# Altium project MainBoard.PrjPcb (part 1 of 2)
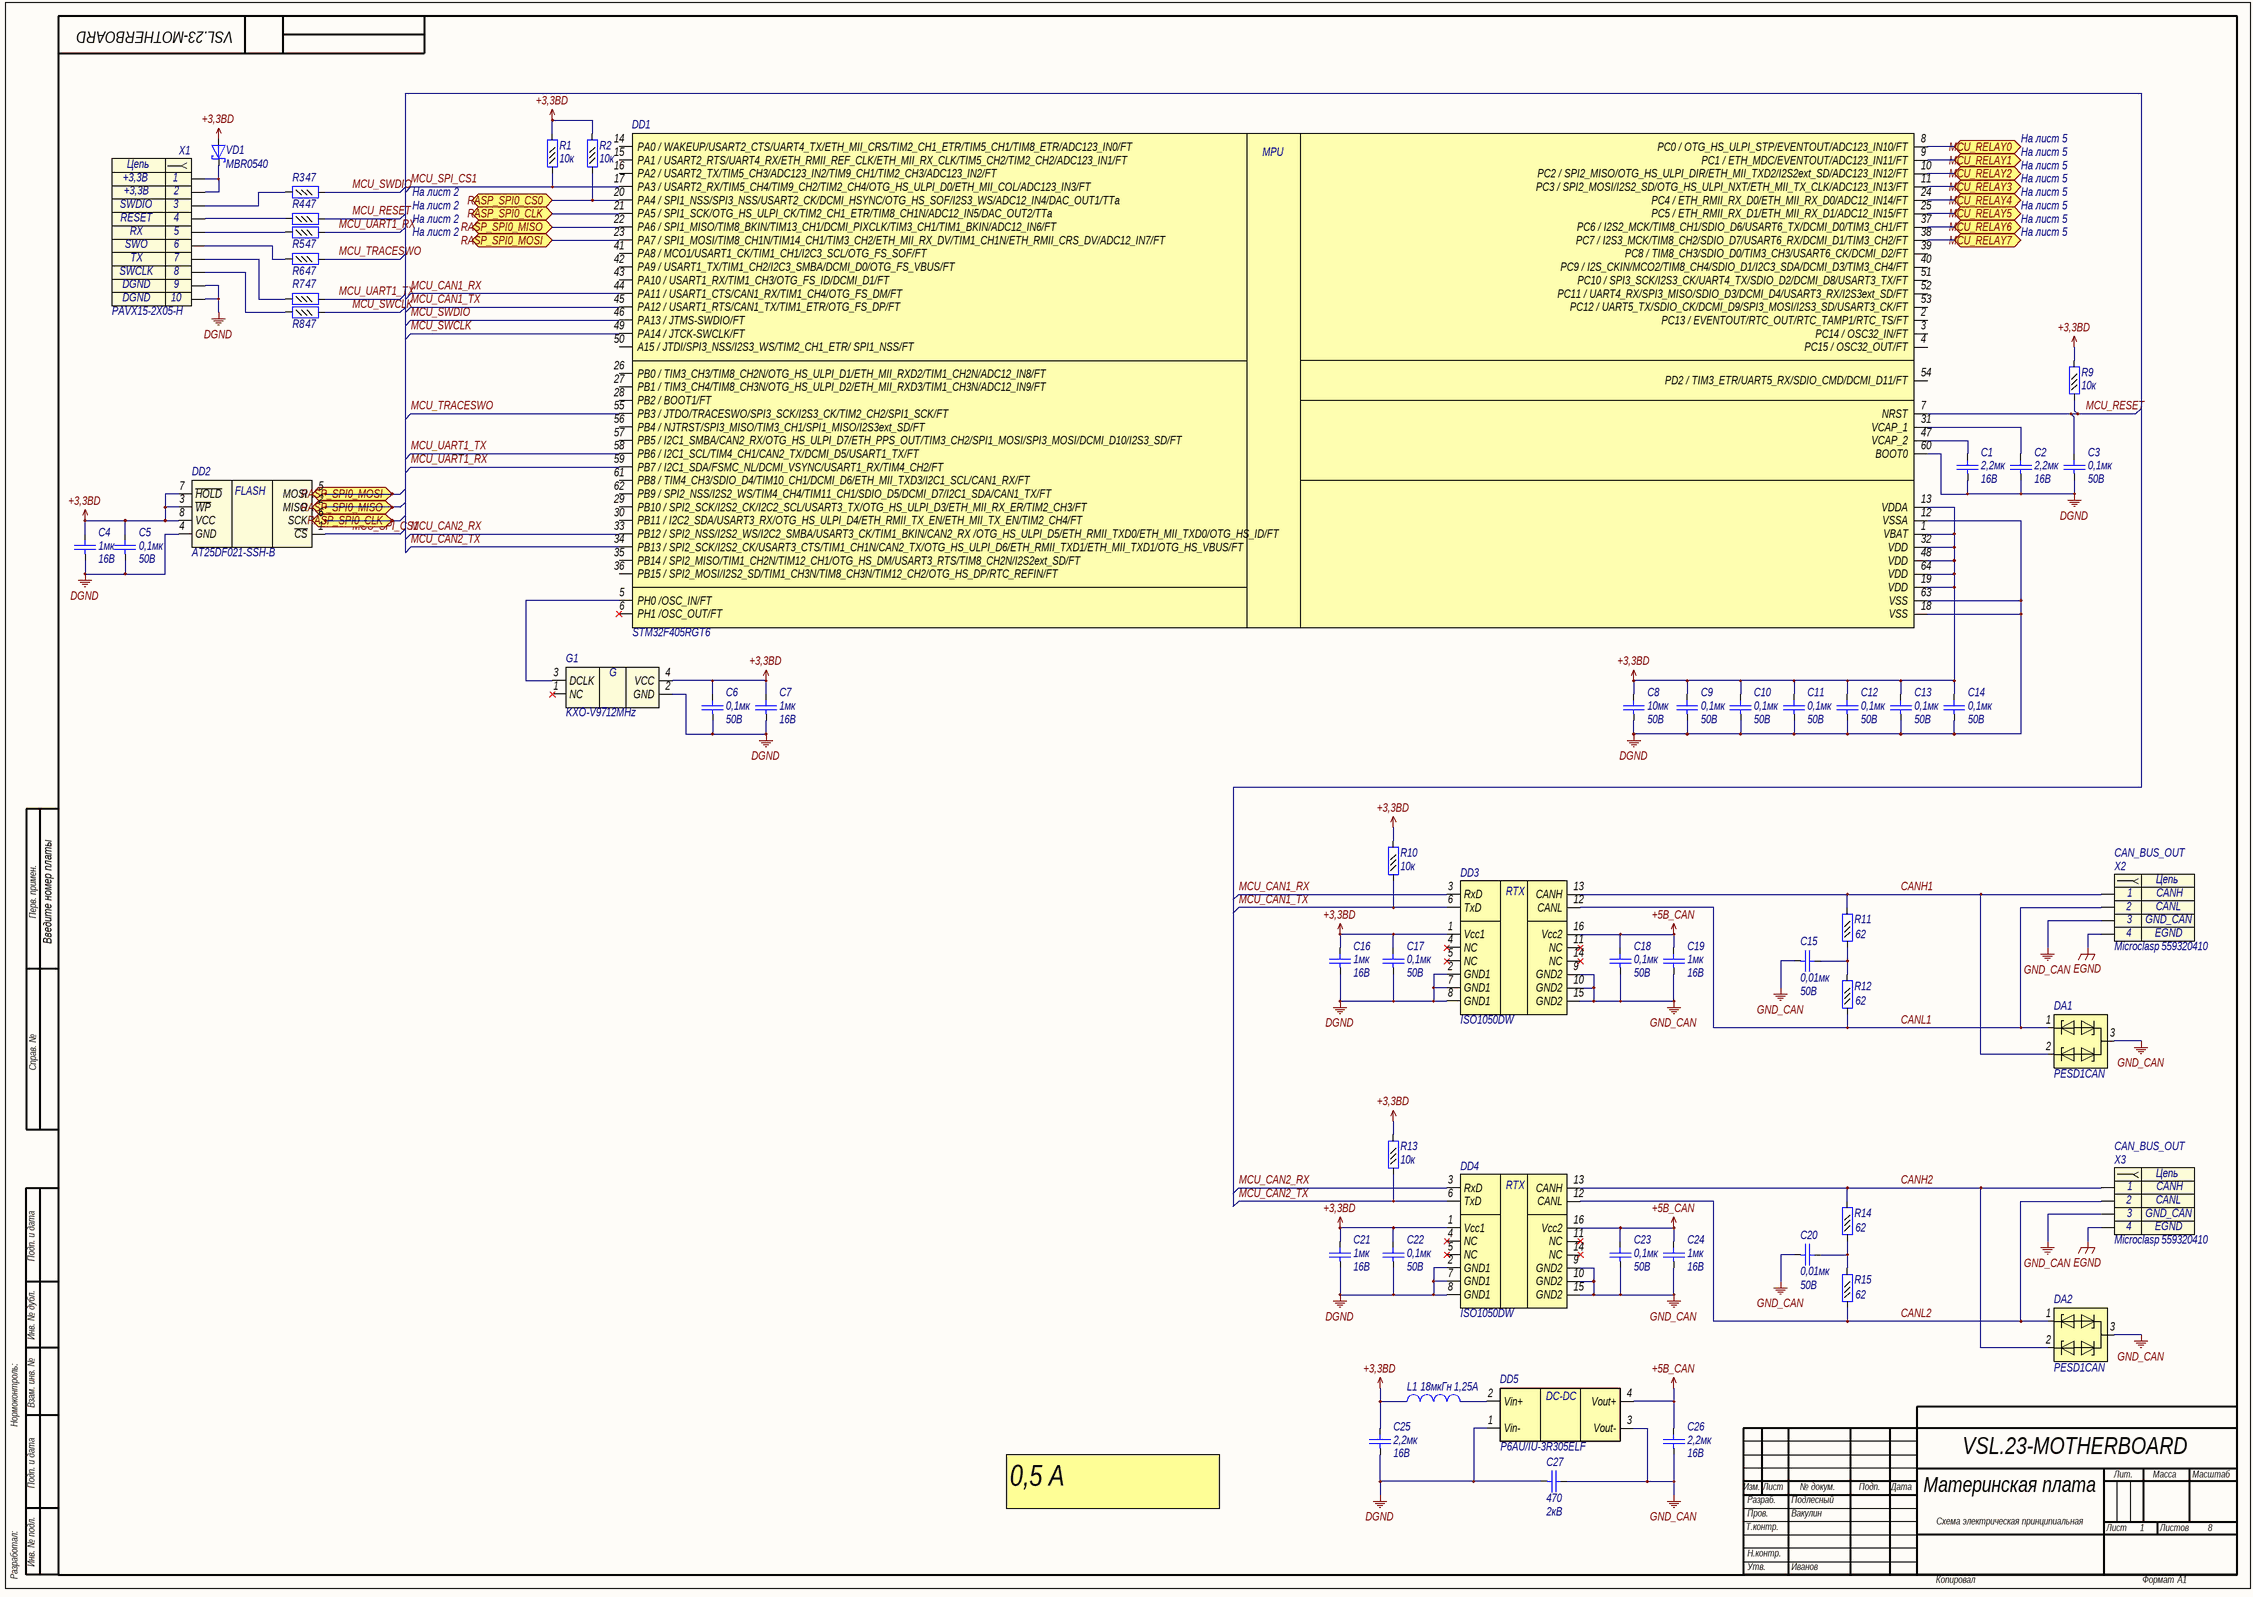
[diagram p0: MainBoard_MCU.SchDoc]
8 sheets, 422 parts. Net scope: flat (ports and power ports of the same name join across sheets).
Board file: MainBoard.PcbDoc
Sheets:
  MainBoard_MCU.SchDoc
  MainBoard_RASP.SchDoc
  MainBoard_ETH.SchDoc
  MainBoard_ETH_RASP.SchDoc
  MainBoard_PERIPH.SchDoc
  MainBoard_RELAY.SchDoc
  MainBoard_PWR.SchDoc
  MainBoard_KONZEVIC.SchDoc

## Sheet MainBoard_MCU.SchDoc: Материнская плата
size 840 x 594 mm; ApprovedBy: Иванов; CheckedBy: Вакулин; DrawnBy: Подлесный; DocumentNumber: VSL.23-MOTHERBOARD; SheetNumber: 1; SheetTotal: 8; DocumentType: Схема электрическая принципиальная; Format: A1; ImagePath: Введите номер платы

### Parts
C1  Voltage: 16B  [C0603]  (hidden comment: 2,2мк)
C2  Voltage: 16B  [C0603]  (hidden comment: 2,2мк)
C3  value 0,1мк  Voltage: 50В  [C0402]  (hidden comment: Capacitor)
C4  value 1мк  Voltage: 16B  [C0603]  (hidden comment: Capacitor)
C5  value 0,1мк  Voltage: 50В  [C0402]  (hidden comment: Capacitor)
C6  value 0,1мк  Voltage: 50В  [C0402]  (hidden comment: Capacitor)
C7  value 1мк  Voltage: 16B  [C0603]  (hidden comment: Capacitor)
C8  Voltage: 50В  [C1210]  (hidden comment: 10мк)
C9  value 0,1мк  Voltage: 50В  [C0402]  (hidden comment: Capacitor)
C10  value 0,1мк  Voltage: 50В  [C0402]  (hidden comment: Capacitor)
C11  value 0,1мк  Voltage: 50В  [C0402]  (hidden comment: Capacitor)
C12  value 0,1мк  Voltage: 50В  [C0402]  (hidden comment: Capacitor)
C13  value 0,1мк  Voltage: 50В  [C0402]  (hidden comment: Capacitor)
C14  value 0,1мк  Voltage: 50В  [C0402]  (hidden comment: Capacitor)
C15  value 0,01мк  Voltage: 50B  [C0402]  (hidden comment: Capacitor)
C16  value 1мк  Voltage: 16B  [C0603]  (hidden comment: Capacitor)
C17  value 0,1мк  Voltage: 50В  [C0402]  (hidden comment: Capacitor)
C18  value 0,1мк  Voltage: 50В  [C0402]  (hidden comment: Capacitor)
C19  value 1мк  Voltage: 16B  [C0603]  (hidden comment: Capacitor)
C20  value 0,01мк  Voltage: 50B  [C0402]  (hidden comment: Capacitor)
C21  value 1мк  Voltage: 16B  [C0603]  (hidden comment: Capacitor)
C22  value 0,1мк  Voltage: 50В  [C0402]  (hidden comment: Capacitor)
C23  value 0,1мк  Voltage: 50В  [C0402]  (hidden comment: Capacitor)
C24  value 1мк  Voltage: 16B  [C0603]  (hidden comment: Capacitor)
C25  Voltage: 16B  [C0603]  (hidden comment: 2,2мк)
C26  Voltage: 16B  [C0603]  (hidden comment: 2,2мк)
C27  value 470  Voltage: 2кВ  [C1206]  (hidden comment: Capacitor)
DA1  Part Number: PESD1CAN  [SOT23-3]  (hidden comment: PESD)
DA2  Part Number: PESD1CAN  [SOT23-3]  (hidden comment: PESD)
DD1  STM32F405RGT6  [LQFP64]
DD2  Part Number: AT25DF021-SSH-B  [SO8]  (hidden comment: AT25DF021)
DD3  (no value)  [SO16]
DD4  (no value)  [SO16]
DD5  Part Number: P6AU/IU-3R305ELF  [SIP4]  (hidden comment: P6AU-xxxxELF)
G1  Frequence: 12MHz  Part Number: KXO-V97  [QSMD7x5.2x1.8]  (hidden comment: KXO)
L1  value 18мкГн  Rated Current: 1,25A  [SDR0604]  (hidden comment: Inductor)
R1  value 10к  [R0402]  (hidden comment: Resistor_0,062Вт)
R2  value 10к  [R0402]  (hidden comment: Resistor_0,062Вт)
R3  value 47  [R0402]  (hidden comment: Resistor_0,062Вт)
R4  value 47  [R0402]  (hidden comment: Resistor_0,062Вт)
R5  value 47  [R0402]  (hidden comment: Resistor_0,062Вт)
R6  value 47  [R0402]  (hidden comment: Resistor_0,062Вт)
R7  value 47  [R0402]  (hidden comment: Resistor_0,062Вт)
R8  value 47  [R0402]  (hidden comment: Resistor_0,062Вт)
R9  value 10к  [R0402]  (hidden comment: Resistor_0,062Вт)
R10  value 10к  [R0402]  (hidden comment: Resistor_0,062Вт)
R11  value 62  [R0402]  (hidden comment: Resistor_0,062Вт)
R12  value 62  [R0402]  (hidden comment: Resistor_0,062Вт)
R13  value 10к  [R0402]  (hidden comment: Resistor_0,062Вт)
R14  value 62  [R0402]  (hidden comment: Resistor_0,062Вт)
R15  value 62  [R0402]  (hidden comment: Resistor_0,062Вт)
VD1  Part Number: MBR0540  [SOD-123]  (hidden comment: DiodeSchottky)
X1  Header_10_sct  [PAVX15-2X05-H]  (value not drawn)
X2  CAN_BUS_OUT  Part Number: 559320410  [MOLEX_559320410]
X3  CAN_BUS_OUT  Part Number: 559320410  [MOLEX_559320410]

### Ports
MCU_RELAY0, MCU_RELAY1, MCU_RELAY2, MCU_RELAY3, MCU_RELAY4, MCU_RELAY5, MCU_RELAY6, MCU_RELAY7, RASP_SPI0_CLK, RASP_SPI0_CS0, RASP_SPI0_MISO, RASP_SPI0_MOSI

### Nets
+3,3BD: C4.2 C5.2 C6.2 C7.2 C8.2 C9.2 C10.2 C11.2 C12.2 C13.2 C14.2 C16.2 C17.2 C21.2 C22.2 C25.2 DD1.1(VBAT) DD1.13(VDDA) DD1.19(VDD) DD1.32(VDD) DD1.48(VDD) DD1.64(VDD) DD2.3(~{WP}) DD2.7(~{HOLD}) DD2.8(VCC) DD3.1(Vcc1) DD4.1(Vcc1) G1.4(VCC) L1.1 R1.2 R2.2 R9.2 R10.2 R13.2 VD1.2(A)
+5B_CAN: C18.2 C19.2 C23.2 C24.2 C26.2 DD3.16(Vcc2) DD4.16(Vcc2) DD5.4(Vout+)
DGND: C1.1 C2.1 C3.1 C4.1 C5.1 C6.1 C7.1 C8.1 C9.1 C10.1 C11.1 C12.1 C13.1 C14.1 C16.1 C17.1 C21.1 C22.1 C25.1 C27.1 DD1.12(VSSA) DD1.18(VSS) DD1.60(BOOT0) DD1.63(VSS) DD2.4(GND) DD3.2(GND1) DD3.7(GND1) DD3.8(GND1) DD4.2(GND1) DD4.7(GND1) DD4.8(GND1) DD5.1(Vin-) G1.2(GND) X1.9 X1.10
EGND: X2.4 X3.4
GND_CAN: C15.1 C18.1 C19.1 C20.1 C23.1 C24.1 C26.1 C27.2 DA1.3 DA2.3 DD3.9(GND2) DD3.10(GND2) DD3.15(GND2) DD4.9(GND2) DD4.10(GND2) DD4.15(GND2) DD5.3(Vout-) X2.3 X3.3
CANH1: DA1.2 DD3.13(CANH) R11.2 X2.1
CANH2: DA2.2 DD4.13(CANH) R14.2 X3.1
CANL1: DA1.1 DD3.12(CANL) R12.1 X2.2
CANL2: DA2.1 DD4.12(CANL) R15.1 X3.2
MCU_CAN1_RX: DD1.44(PA11_/_USART1_CTS/CAN1_RX/TIM1_CH4/OTG_FS_DM/FT) DD3.3(RxD)
MCU_CAN1_TX: DD1.45(PA12_/_USART1_RTS/CAN1_TX/TIM1_ETR/OTG_FS_DP/FT) DD3.6(TxD) R10.1
MCU_CAN2_RX: DD1.33(PB12_/_SPI2_NSS/I2S2_WS/I2C2_SMBA/USART3_CK/TIM1_BKIN/CAN2_RX_/OTG_HS_ULPI_D5/ETH_RMII_TXD0/ETH_MII_TXD0/OTG_HS_ID/FT) DD4.3(RxD)
MCU_CAN2_TX: DD1.34(PB13_/_SPI2_SCK/I2S2_CK/USART3_CTS/TIM1_CH1N/CAN2_TX/OTG_HS_ULPI_D6/ETH_RMII_TXD1/ETH_MII_TXD1/OTG_HS_VBUS/FT) DD4.6(TxD) R13.1
MCU_RESET: C3.2 DD1.7(NRST) R4.2 R9.1
MCU_SPI_CS1: DD1.17(PA3_/_USART2_RX/TIM5_CH4/TIM9_CH2/TIM2_CH4/OTG_HS_ULPI_D0/ETH_MII_COL/ADC123_IN3/FT) DD2.1(~{CS}) R1.1
MCU_SWCLK: DD1.49(PA14_/_JTCK-SWCLK/FT) R8.2
MCU_SWDIO: DD1.46(PA13_/_JTMS-SWDIO/FT) R3.2
MCU_TRACESWO: DD1.55(PB3_/_JTDO/TRACESWO/SPI3_SCK/I2S3_CK/TIM2_CH2/SPI1_SCK/FT) R6.2
MCU_UART1_RX: DD1.59(PB7_/_I2C1_SDA/FSMC_NL/DCMI_VSYNC/USART1_RX/TIM4_CH2/FT) R5.2
MCU_UART1_TX: DD1.58(PB6_/_I2C1_SCL/TIM4_CH1/CAN2_TX/DCMI_D5/USART1_TX/FT) R7.2
NetC1_2: C1.2 DD1.47(VCAP_2)
NetC2_2: C2.2 DD1.31(VCAP_1)
NetC15_2: C15.2 R11.1 R12.2
NetC20_2: C20.2 R14.1 R15.2
NetDD1_5: DD1.5(PH0_/OSC_IN/FT) G1.3(DCLK)
NetDD1_8: DD1.8(PC0_/_OTG_HS_ULPI_STP/EVENTOUT/ADC123_IN10/FT) ; port MCU_RELAY0
NetDD1_9: DD1.9(PC1_/_ETH_MDC/EVENTOUT/ADC123_IN11/FT) ; port MCU_RELAY1
NetDD1_10: DD1.10(PC2_/_SPI2_MISO/OTG_HS_ULPI_DIR/ETH_MII_TXD2/I2S2ext_SD/ADC123_IN12/FT) ; port MCU_RELAY2
NetDD1_11: DD1.11(PC3_/_SPI2_MOSI/I2S2_SD/OTG_HS_ULPI_NXT/ETH_MII_TX_CLK/ADC123_IN13/FT) ; port MCU_RELAY3
NetDD1_20: DD1.20(PA4_/_SPI1_NSS/SPI3_NSS/USART2_CK/DCMI_HSYNC/OTG_HS_SOF/I2S3_WS/ADC12_IN4/DAC_OUT1/TTa) R2.1 ; port RASP_SPI0_CS0
NetDD1_21: DD1.21(PA5_/_SPI1_SCK/OTG_HS_ULPI_CK/TIM2_CH1_ETR/TIM8_CH1N/ADC12_IN5/DAC_OUT2/TTa) DD2.6(SCK) ; port RASP_SPI0_CLK
NetDD1_22: DD1.22(PA6_/_SPI1_MISO/TIM8_BKIN/TIM13_CH1/DCMI_PIXCLK/TIM3_CH1/TIM1_BKIN/ADC12_IN6/FT) DD2.2(MISO) ; port RASP_SPI0_MISO
NetDD1_23: DD1.23(PA7_/_SPI1_MOSI/TIM8_CH1N/TIM14_CH1/TIM3_CH2/ETH_MII_RX_DV/TIM1_CH1N/ETH_RMII_CRS_DV/ADC12_IN7/FT) DD2.5(MOSI) ; port RASP_SPI0_MOSI
NetDD1_24: DD1.24(PC4_/_ETH_RMII_RX_D0/ETH_MII_RX_D0/ADC12_IN14/FT) ; port MCU_RELAY4
NetDD1_25: DD1.25(PC5_/_ETH_RMII_RX_D1/ETH_MII_RX_D1/ADC12_IN15/FT) ; port MCU_RELAY5
NetDD1_37: DD1.37(PC6_/_I2S2_MCK/TIM8_CH1/SDIO_D6/USART6_TX/DCMI_D0/TIM3_CH1/FT) ; port MCU_RELAY6
NetDD1_38: DD1.38(PC7_/_I2S3_MCK/TIM8_CH2/SDIO_D7/USART6_RX/DCMI_D1/TIM3_CH2/FT) ; port MCU_RELAY7
NetDD5_2: DD5.2(Vin+) L1.2
NetR3_1: R3.1 X1.3
NetR4_1: R4.1 X1.4
NetR5_1: R5.1 X1.5
NetR6_1: R6.1 X1.6
NetR7_1: R7.1 X1.7
NetR8_1: R8.1 X1.8
NetVD1_1: VD1.1(K) X1.1 X1.2

Not connected (* = marked no-connect by the designer): DD1 2(PC13_/_EVENTOUT/RTC_OUT/RTC_TAMP1/RTC_TS/FT) 3(PC14_/_OSC32_IN/FT) 4(PC15_/_OSC32_OUT/FT) 6(PH1_/OSC_OUT/FT)* 14(PA0_/_WAKEUP/USART2_CTS/UART4_TX/ETH_MII_CRS/TIM2_CH1_ETR/TIM5_CH1/TIM8_ETR/ADC123_IN0/FT) 15(PA1_/_USART2_RTS/UART4_RX/ETH_RMII_REF_CLK/ETH_MII_RX_CLK/TIM5_CH2/TIM2_CH2/ADC123_IN1/FT) 16(PA2_/_USART2_TX/TIM5_CH3/ADC123_IN2/TIM9_CH1/TIM2_CH3/ADC123_IN2/FT) 26(PB0_/_TIM3_CH3/TIM8_CH2N/OTG_HS_ULPI_D1/ETH_MII_RXD2/TIM1_CH2N/ADC12_IN8/FT) 27(PB1_/_TIM3_CH4/TIM8_CH3N/OTG_HS_ULPI_D2/ETH_MII_RXD3/TIM1_CH3N/ADC12_IN9/FT) 28(PB2_/_BOOT1/FT) 29(PB10_/_SPI2_SCK/I2S2_CK/I2C2_SCL/USART3_TX/OTG_HS_ULPI_D3/ETH_MII_RX_ER/TIM2_CH3/FT) 30(PB11_/_I2C2_SDA/USART3_RX/OTG_HS_ULPI_D4/ETH_RMII_TX_EN/ETH_MII_TX_EN/TIM2_CH4/FT) 35(PB14_/_SPI2_MISO/TIM1_CH2N/TIM12_CH1/OTG_HS_DM/USART3_RTS/TIM8_CH2N/I2S2ext_SD/FT) 36(PB15_/_SPI2_MOSI/I2S2_SD/TIM1_CH3N/TIM8_CH3N/TIM12_CH2/OTG_HS_DP/RTC_REFIN/FT) 39(PC8_/_TIM8_CH3/SDIO_D0/TIM3_CH3/USART6_CK/DCMI_D2/FT) 40(PC9_/_I2S_CKIN/MCO2/TIM8_CH4/SDIO_D1/I2C3_SDA/DCMI_D3/TIM3_CH4/FT) 41(PA8_/_MCO1/USART1_CK/TIM1_CH1/I2C3_SCL/OTG_FS_SOF/FT) 42(PA9_/_USART1_TX/TIM1_CH2/I2C3_SMBA/DCMI_D0/OTG_FS_VBUS/FT) 43(PA10_/_USART1_RX/TIM1_CH3/OTG_FS_ID/DCMI_D1/FT) 50(A15_/_JTDI/SPI3_NSS/I2S3_WS/TIM2_CH1_ETR/_SPI1_NSS/FT) 51(PC10_/_SPI3_SCK/I2S3_CK/UART4_TX/SDIO_D2/DCMI_D8/USART3_TX/FT) 52(PC11_/_UART4_RX/SPI3_MISO/SDIO_D3/DCMI_D4/USART3_RX/I2S3ext_SD/FT) 53(PC12_/_UART5_TX/SDIO_CK/DCMI_D9/SPI3_MOSI/I2S3_SD/USART3_CK/FT) 54(PD2_/_TIM3_ETR/UART5_RX/SDIO_CMD/DCMI_D11/FT) 56(PB4_/_NJTRST/SPI3_MISO/TIM3_CH1/SPI1_MISO/I2S3ext_SD/FT) 57(PB5_/_I2C1_SMBA/CAN2_RX/OTG_HS_ULPI_D7/ETH_PPS_OUT/TIM3_CH2/SPI1_MOSI/SPI3_MOSI/DCMI_D10/I2S3_SD/FT) 61(PB8_/_TIM4_CH3/SDIO_D4/TIM10_CH1/DCMI_D6/ETH_MII_TXD3/I2C1_SCL/CAN1_RX/FT) 62(PB9_/_SPI2_NSS/I2S2_WS/TIM4_CH4/TIM11_CH1/SDIO_D5/DCMI_D7/I2C1_SDA/CAN1_TX/FT); DD3 4(NC)* 5(NC)* 11(NC)* 14(NC)*; DD4 4(NC)* 5(NC)* 11(NC)* 14(NC)*; G1 1(NC)*

### Notes on the sheet
- На лист 5
- На лист 2
- Перв. примен.
- (near X2) Microclasp
- Справ. №
- Подп. и дата
- (near X3) Microclasp
- Инв. № дубл.
- Нормоконтроль:
- Взам. инв. №
- Изм.
- Лист
- № докум.
- Подп.
- Дата
- Лит.
- Масса
- Масштаб
- 0,5 А
- Т.контр.
- Пров.
- Разраб.
- Листов
- Разработал:
- Инв. № подл.
- Н.контр.
- Утв.
- Копировал
- Формат
- (in symbol AT25DF021-SSH-B) FLASH
- (in symbol connect97) Цепь
- (in symbol connect107) Цепь
- (in symbol crystal10) G
- (in symbol interf22) RTX
- (in symbol microcont10) MPU
- (in symbol pwr54) DC-DC

### Library data of the parts
C1 C2 C25 C26 = cap287: Конденсатор; Part Name: Ceramic; Manufacture: Murata; Part Number: GRM188Z71C225ME43J; id: cap287; TKE: X7R; tga: 0,10%; Value: 2,2мк
C3 C5 C6 C9-C14 C17 C18 C22 C23 = cap277: Конденсатор; Part Name: Ceramic; Manufacture: Murata; Part Number: GRM155R71H104KE14D; id: cap277; TKE: X7R; tga: 0,10%
C4 C7 C16 C19 C21 C24 = cap133: Конденсатор; Part Name: Ceramic; Manufacture: Murata; Part Number: GRM188R71C105KA12D**; id: cap133; TKE: X7R
C8 = cap297: Конденсатор; Part Name: MLCC; Manufacture: TDK; Part Number: C3225X7R1H106K250AC; id: cap297; TKE: X7R; tga: 0,10%; Value: 10мк
C15 C20 = cap42: Конденсатор; Part Name: Ceramic; Manufacture: Murata; Part Number: GRM155R71H103K; id: cap42; TKE: X7R
C27 = cap284: Конденсатор; Part Name: Ceramic; Manufacture: Yageo; Part Number: CC1206KKX7RDBB471; id: cap284; TKE: X7R
DA1 DA2 = PESD1CAN: TVS; Part Name: CAN bus ESD protection diode; Manufacture: Nexperia; id: esd5; Max Reverse Voltage: 24B; Breakdown Voltage: 25,4B; Capacitance: 17pF; Number of Channels: 2
DD1 = microcont10: Part Name: Microcontroller; Frequency: 168MHz; ADC: 16x12b/2x12b; Interface: can, i2c, irda, lin, spi, uart, usbotg,sdio; Flash: 1Mb; Pin in: 51; Power Supply: 1.8-3.6V; id: microcont10; Part Number: STM32F405RGT6
DD2 = AT25DF021-SSH-B: SPI Serial Flash  Memory; Manufacturer: Adesto; id: mem1; Memory Size: 2Mbit; Power Supply: 2.7-3.6 V; Part Name: Flash; Interface: spi
DD3 DD4 = interf22: Isolated CAN Transceiver; Manufacture: Texas Instruments; Number of Channel: 1; Type Supply: Single Polar; Current Consumption: 76mA; Power Supply: 3-5,5В/4,75-5,25В; id: interf22; Part Name: Isolated CAN Transceiver; Part Number: ISO1050DW
DD5 = pwr54: DC/DC преобразователь; Part Name: DC/DC Converter Isolated; Manufacturer: PEAK Electronics; id: pwr54; Input Voltage: 3,3B; Output Voltage: 5B; Current: 200mA; Type: Isolated
G1 = crystal10: Кварц. генер. 32.768 МГц (HCMOS/TTL); Manufacture: GEYER; id: crystal10
L1 = ind45: EMI Suppression Filter; Part Name: SMD Power Inductors; Part Number: SDR0604- 180YL; Manufacture: Bourns; id: ind45; Saturation Current: 1,5A; Resistance: 0,15Ohm
R1 R2 R9 R10 R13 = res294: Резистор; Manufacture: Yageo; Part Number: RC0402FR-0710KL; id: res294; Accuracy: 0,01; Part Name: Resistor; Power: 0,062Вт
R3-R8 = res238: Резистор; Manufacture: Yageo; Part Number: RC0402FR-0747RL; id: res238; Accuracy: 0,01; Part Name: Resistor; Power: 0,062Вт
R11 R12 R14 R15 = res241: Резистор; Manufacture: Yageo; Part Number: RC0402FR-0762RL; id: res241; Accuracy: 0,01; Part Name: Resistor; Power: 0,062Вт
VD1 = diode15: Диод Шоттки; Manufacture: ON Semiconductor; Max Reverse Voltage: 40B; Forward Voltage: 0,62B; Forward Current: 0,5А; Capacitance: 30pF; Number of Channels: 1; id: diode15; Part Name: Diode Schottky
X1 = connect107: Разъем - 10 конт. розетка; Part Name: Штыри двухрядные 2x5; Manufacture: Auk Contractors; Contact_1: +3,3B; Contact_3: SWDIO; Contact_4: RESET; Contact_5: RX; Contact_6: SWO; Etch: 1.27mm; Contact_7: TX; Contact_8: SWCLK; Contact_9: DGND; Contact_2: +3,3B; id: connect107; Part Number: PAVX15-2X05-H; Contact_10: DGND
X2 X3 = connect97: Разъем - 4 конт. розетка; Part Name: MicroClasp Wire-to-Board Header; Manufacture: Molex; Contact_1: CANH; Contact_2: CANL; Contact_3: GND_CAN; Contact_4: EGND; Etch: 2mm; id: connect97

## Sheet MainBoard_RASP.SchDoc
size 594 x 420 mm; DocumentNumber: VSL.23-MOTHERBOARD; SheetNumber: 2; Format: A2
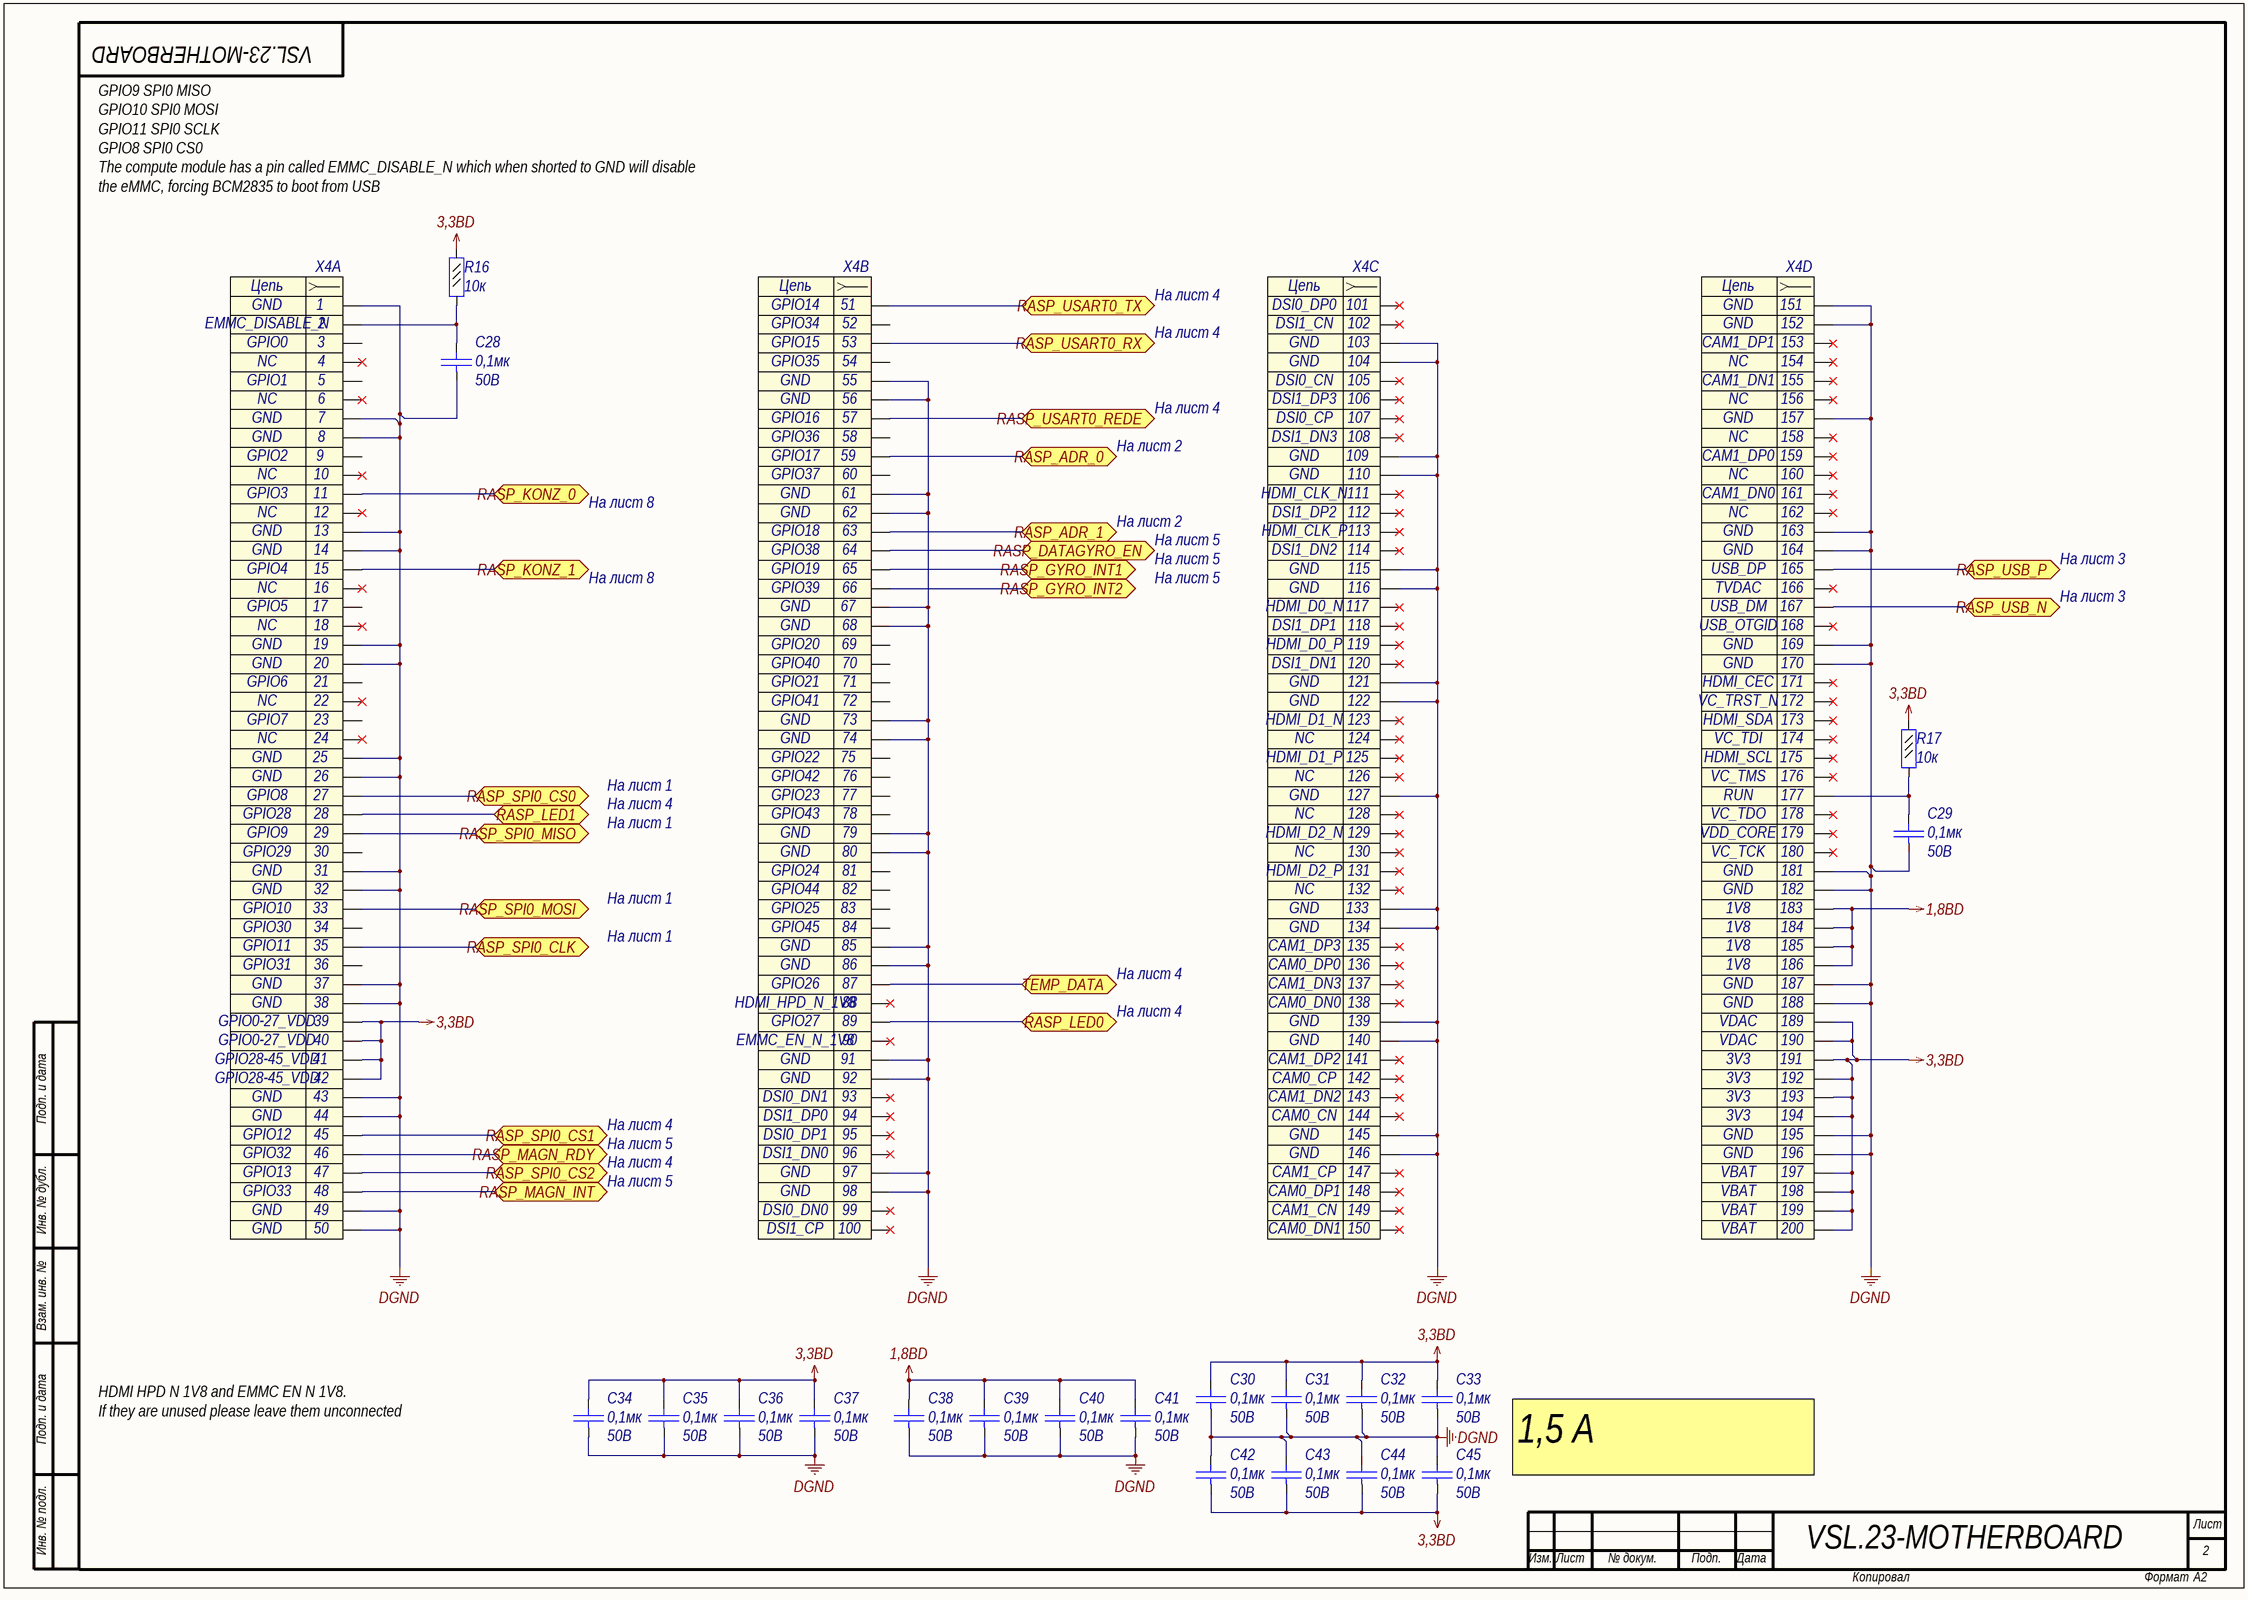
[diagram p1: MainBoard_RASP.SchDoc]

### Parts
C28  value 0,1мк  Voltage: 50B  [C0402]  (hidden comment: Capacitor)
C29  value 0,1мк  Voltage: 50B  [C0402]  (hidden comment: Capacitor)
C30  value 0,1мк  Voltage: 50B  [C0402]  (hidden comment: Capacitor)
C31  value 0,1мк  Voltage: 50B  [C0402]  (hidden comment: Capacitor)
C32  value 0,1мк  Voltage: 50B  [C0402]  (hidden comment: Capacitor)
C33  value 0,1мк  Voltage: 50B  [C0402]  (hidden comment: Capacitor)
C34  value 0,1мк  Voltage: 50B  [C0402]  (hidden comment: Capacitor)
C35  value 0,1мк  Voltage: 50B  [C0402]  (hidden comment: Capacitor)
C36  value 0,1мк  Voltage: 50B  [C0402]  (hidden comment: Capacitor)
C37  value 0,1мк  Voltage: 50B  [C0402]  (hidden comment: Capacitor)
C38  value 0,1мк  Voltage: 50B  [C0402]  (hidden comment: Capacitor)
C39  value 0,1мк  Voltage: 50B  [C0402]  (hidden comment: Capacitor)
C40  value 0,1мк  Voltage: 50B  [C0402]  (hidden comment: Capacitor)
C41  value 0,1мк  Voltage: 50B  [C0402]  (hidden comment: Capacitor)
C42  value 0,1мк  Voltage: 50B  [C0402]  (hidden comment: Capacitor)
C43  value 0,1мк  Voltage: 50B  [C0402]  (hidden comment: Capacitor)
C44  value 0,1мк  Voltage: 50B  [C0402]  (hidden comment: Capacitor)
C45  value 0,1мк  Voltage: 50B  [C0402]  (hidden comment: Capacitor)
R16  value 10к  [R0402]  (hidden comment: Resistor_0,062Вт)
R17  value 10к  [R0402]  (hidden comment: Resistor_0,062Вт)
X4  (no value)  [SODIMM 200P]  (parts A,B,C,D of 4)

### Ports
RASP_ADR_0, RASP_ADR_1, RASP_DATAGYRO_EN, RASP_GYRO_INT1, RASP_GYRO_INT2, RASP_KONZ_0, RASP_KONZ_1, RASP_LED0, RASP_LED1, RASP_MAGN_INT, RASP_MAGN_RDY, RASP_SPI0_CLK, RASP_SPI0_CS0, RASP_SPI0_CS1, RASP_SPI0_CS2, RASP_SPI0_MISO, RASP_SPI0_MOSI, RASP_USART0_REDE, RASP_USART0_RX, RASP_USART0_TX, RASP_USB_N, RASP_USB_P, TEMP_DATA

### Nets
1,8BD: C38.2 C39.2 C40.2 C41.2 X4.183 X4.184 X4.185 X4.186
3,3BD: C30.2 C31.2 C32.2 C33.2 C34.2 C35.2 C36.2 C37.2 C42.1 C43.1 C44.1 C45.1 R16.1 R17.1 X4.39 X4.40 X4.41 X4.42 X4.189 X4.190 X4.191 X4.192 X4.193 X4.194 X4.197 X4.198 X4.199 X4.200
DGND: C28.1 C29.1 C30.1 C31.1 C32.1 C33.1 C34.1 C35.1 C36.1 C37.1 C38.1 C39.1 C40.1 C41.1 C42.2 C43.2 C44.2 C45.2 X4.1 X4.7 X4.8 X4.13 X4.14 X4.19 X4.20 X4.25 X4.26 X4.31 X4.32 X4.37 X4.38 X4.43 X4.44 X4.49 X4.50 X4.55 X4.56 X4.61 X4.62 X4.67 X4.68 X4.73 X4.74 X4.79 X4.80 X4.85 X4.86 X4.91 X4.92 X4.97 X4.98 X4.103 X4.104 X4.109 X4.110 X4.115 X4.116 X4.121 X4.122 X4.127 X4.133 X4.134 X4.139 X4.140 X4.145 X4.146 X4.151 X4.152 X4.157 X4.163 X4.164 X4.169 X4.170 X4.181 X4.182 X4.187 X4.188 X4.195 X4.196
NetC28_2: C28.2 R16.2 X4.2
NetC29_2: C29.2 R17.2 X4.177
NetDD1_20: X4.27 ; port RASP_SPI0_CS0
NetDD1_21: X4.35 ; port RASP_SPI0_CLK
NetDD1_22: X4.29 ; port RASP_SPI0_MISO
NetDD1_23: X4.33 ; port RASP_SPI0_MOSI
NetL2_3: X4.165 ; port RASP_USB_P
NetL2_4: X4.167 ; port RASP_USB_N
NetR102_2: X4.53 ; port RASP_USART0_RX
NetR103_2: X4.51 ; port RASP_USART0_TX
NetR104_2: X4.57 ; port RASP_USART0_REDE
NetR110_1: X4.63 ; port RASP_ADR_1
NetR111_1: X4.59 ; port RASP_ADR_0
NetR112_1: X4.89 ; port RASP_LED0
NetR113_2: X4.47 ; port RASP_SPI0_CS2
NetR114_2: X4.45 ; port RASP_SPI0_CS1
NetR116_1: X4.28 ; port RASP_LED1
NetR121_2: X4.46 ; port RASP_MAGN_RDY
NetR122_2: X4.48 ; port RASP_MAGN_INT
NetR123_1: X4.87 ; port TEMP_DATA
NetR124_2: X4.65 ; port RASP_GYRO_INT1
NetR125_2: X4.64 ; port RASP_DATAGYRO_EN
NetR126_2: X4.66 ; port RASP_GYRO_INT2
NetR160_2: X4.11 ; port RASP_KONZ_0
NetR164_2: X4.15 ; port RASP_KONZ_1

Not connected (* = marked no-connect by the designer): X4 3 4* 5 6* 9 10* 12* 16* 17 18* 21 22* 23 24* 30 34 36 52 54 58 60 69 70 71 72 75 76 77 78 81 82 83 84 88* 90* 93* 94* 95* 96* 99* 100* 101* 102* 105* 106* 107* 108* 111* 112* 113* 114* 117* 118* 119* 120* 123* 124* 125* 126* 128* 129* 130* 131* 132* 135* 136* 137* 138* 141* 142* 143* 144* 147* 148* 149* 150* 153* 154* 155* 156* 158* 159* 160* 161* 162* 166* 168* 171* 172* 173* 174* 175* 176* 178* 179* 180*

### Notes on the sheet
- GPIO9 SPI0 MISO
  GPIO10 SPI0 MOSI
  GPIO11 SPI0 SCLK
  GPIO8 SPI0 CS0
  The compute module has a pin called EMMC_DISABLE_N which when shorted to GND will disable the eMMC, forcing BCM2835 to boot from USB
- На лист 4
- На лист 2
- На лист 8
- На лист 5
- На лист 3
- На лист 1
- Подп. и дата
- Инв. № дубл.
- Взам. инв. №
- HDMI HPD N 1V8 and EMMC EN N 1V8.
  If they are unused please leave them unconnected
- 1,5 А
- Инв. № подл.
- Лист
- Изм.
- № докум.
- Подп.
- Дата
- Копировал
- Формат
- (in symbol connect90, part A) Цепь
- (in symbol connect90, part B) Цепь
- (in symbol connect90, part C) Цепь
- (in symbol connect90, part D) Цепь

### Library data of the parts
C28-C45 = cap131: Конденсатор; Part Name: Ceramic; Manufacture: Murata; Part Number: GRM188R71H104KA93D; id: cap131; TKE: X7R
R16 R17 = res294: as R1 on sheet MainBoard_MCU; Part Name: Resistor; Power: 0,062Вт
X4 = connect90: Разъем - 5 конт. розетка; Part Name: DDR2 SODIMM connectors; Contact_1: GND; Contact_2: EMMC_DISABLE_N; Contact_3: GPIO0; Contact_4: NC; Contact_5: GPIO1; Contact_9: GPIO2; Contact_11: GPIO3; Contact_15: GPIO4; Contact_17: GPIO5; Contact_21: GPIO6; Contact_23: GPIO7; Contact_27: GPIO8; Contact_28: GPIO28; Contact_29: GPIO9; Contact_30: GPIO29; Contact_33: GPIO10; Contact_34: GPIO30; Contact_35: GPIO11; Contact_36: GPIO31; Contact_39: GPIO0-27_VDD; Contact_41: GPIO28-45_VDD; Contact_45: GPIO12; Contact_46: GPIO32; Contact_47: GPIO13; Contact_48: GPIO33; F81: Contact_75; F82: Contact_76; F83: Contact_77; F84: Contact_78; F85: Contact_79; F86: Contact_80; F87: Contact_81; F88: Contact_82; F89: Contact_83; F90: Contact_84; F91: Contact_85; F92: Contact_86; F93: Contact_87; F94: Contact_88; F95: Contact_89; F96: Contact_90; F97: Contact_91; F98: Contact_92; F99: Contact_93; F100: Contact_94; F101: Contact_95; F102: Contact_96; F103: Contact_97; F104: Contact_98; F105: Contact_99; F106: Contact_100; F107: Contact_101; F108: Contact_102; F109: Contact_103; F110: Contact_104; F111: Contact_105; F112: Contact_106; F113: Contact_107; F114: Contact_108; F115: Contact_109; F116: Contact_110; F117: Contact_111; F118: Contact_112; F119: Contact_113; F120: Contact_114; F121: Contact_115; F122: Contact_116; F123: Contact_117; F124: Contact_118; F125: Contact_119; F126: Contact_120; F127: Contact_121; F128: Contact_122; F129: Contact_123; F130: Contact_124; F131: Contact_125; F132: Contact_126; F133: Contact_127; F134: Contact_128; F135: Contact_129; F136: Contact_130; F137: Contact_131; F138: Contact_132; F139: Contact_133; F140: Contact_134; F141: Contact_135; F142: Contact_136; F143: Contact_137; F144: Contact_138; F145: Contact_139; F146: Contact_140; F147: Contact_141; F148: Contact_142; F149: Contact_143; F150: Contact_144; F151: Contact_145; F152: Contact_146; F153: Contact_147; F154: Contact_148; F155: Contact_149; F156: Contact_150; F157: Contact_151; F158: Contact_152; F159: Contact_153; F160: Contact_154; F161: Contact_155; F162: Contact_156; F163: Contact_157; F164: Contact_158; F165: Contact_159; F166: Contact_160; F167: Contact_161; F168: Contact_162; F169: Contact_163; F170: Contact_164; F171: Contact_165; F172: Contact_166; F173: Contact_167; F174: Contact_168; F175: Contact_169; F176: Contact_170; F177: Contact_171; F178: Contact_172; F179: Contact_173; F180: Contact_174; F181: Contact_175; F182: Contact_176; F183: Contact_177; F184: Contact_178; F185: Contact_179; F186: Contact_180; F187: Contact_181; F188: Contact_182; F189: Contact_183; F190: Contact_184; F191: Contact_185; F192: Contact_186; F193: Contact_187; F194: Contact_188; F195: Contact_189; F196: Contact_190; F197: Contact_191; F198: Contact_192; F199: Contact_193; F200: Contact_194; F201: Contact_195; F202: Contact_196; F203: Contact_197; F204: Contact_198; F205: Contact_199; F206: Contact_200; Contact_6: NC; id: connect90; Contact_7: GND; Contact_8: GND; Contact_10: NC; Contact_12: NC; Contact_13: GND; Contact_14: GND; Contact_16: NC; Contact_18: NC; Contact_19: GND; Contact_20: GND; Contact_22: NC; Contact_24: NC; Contact_25: GND; Contact_26: GND; Contact_31: GND; Contact_32: GND; Contact_37: GND; Contact_38: GND; Contact_40: GPIO0-27_VDD; Contact_42: GPIO28-45_VDD; Contact_43: GND; Contact_44: GND; Contact_49: GND; Contact_50: GND; Contact_51: Contact_51; Contact_52: Contact_52; Contact_53: Contact_53; Contact_54: Contact_54; Contact_55: Contact_55; Contact_56: Contact_56; Contact_57: Contact_57; Contact_58: Contact_58; Contact_59: Contact_59; Contact_60: Contact_60; Contact_61: Contact_61; Contact_62: Contact_62; Contact_63: Contact_63; Contact_64: Contact_64; Contact_65: Contact_65; Contact_66: Contact_66; Contact_67: Contact_67; Contact_68: Contact_68; Contact_69: Contact_69; Contact_70: Contact_70; Contact_71: Contact_71; Contact_73: Contact_73; Contact_72: Contact_72; Contact_74: Contact_74

## Sheet MainBoard_ETH.SchDoc
size 840 x 594 mm; DocumentNumber: VSL.23-MOTHERBOARD; SheetNumber: 3; Format: A1
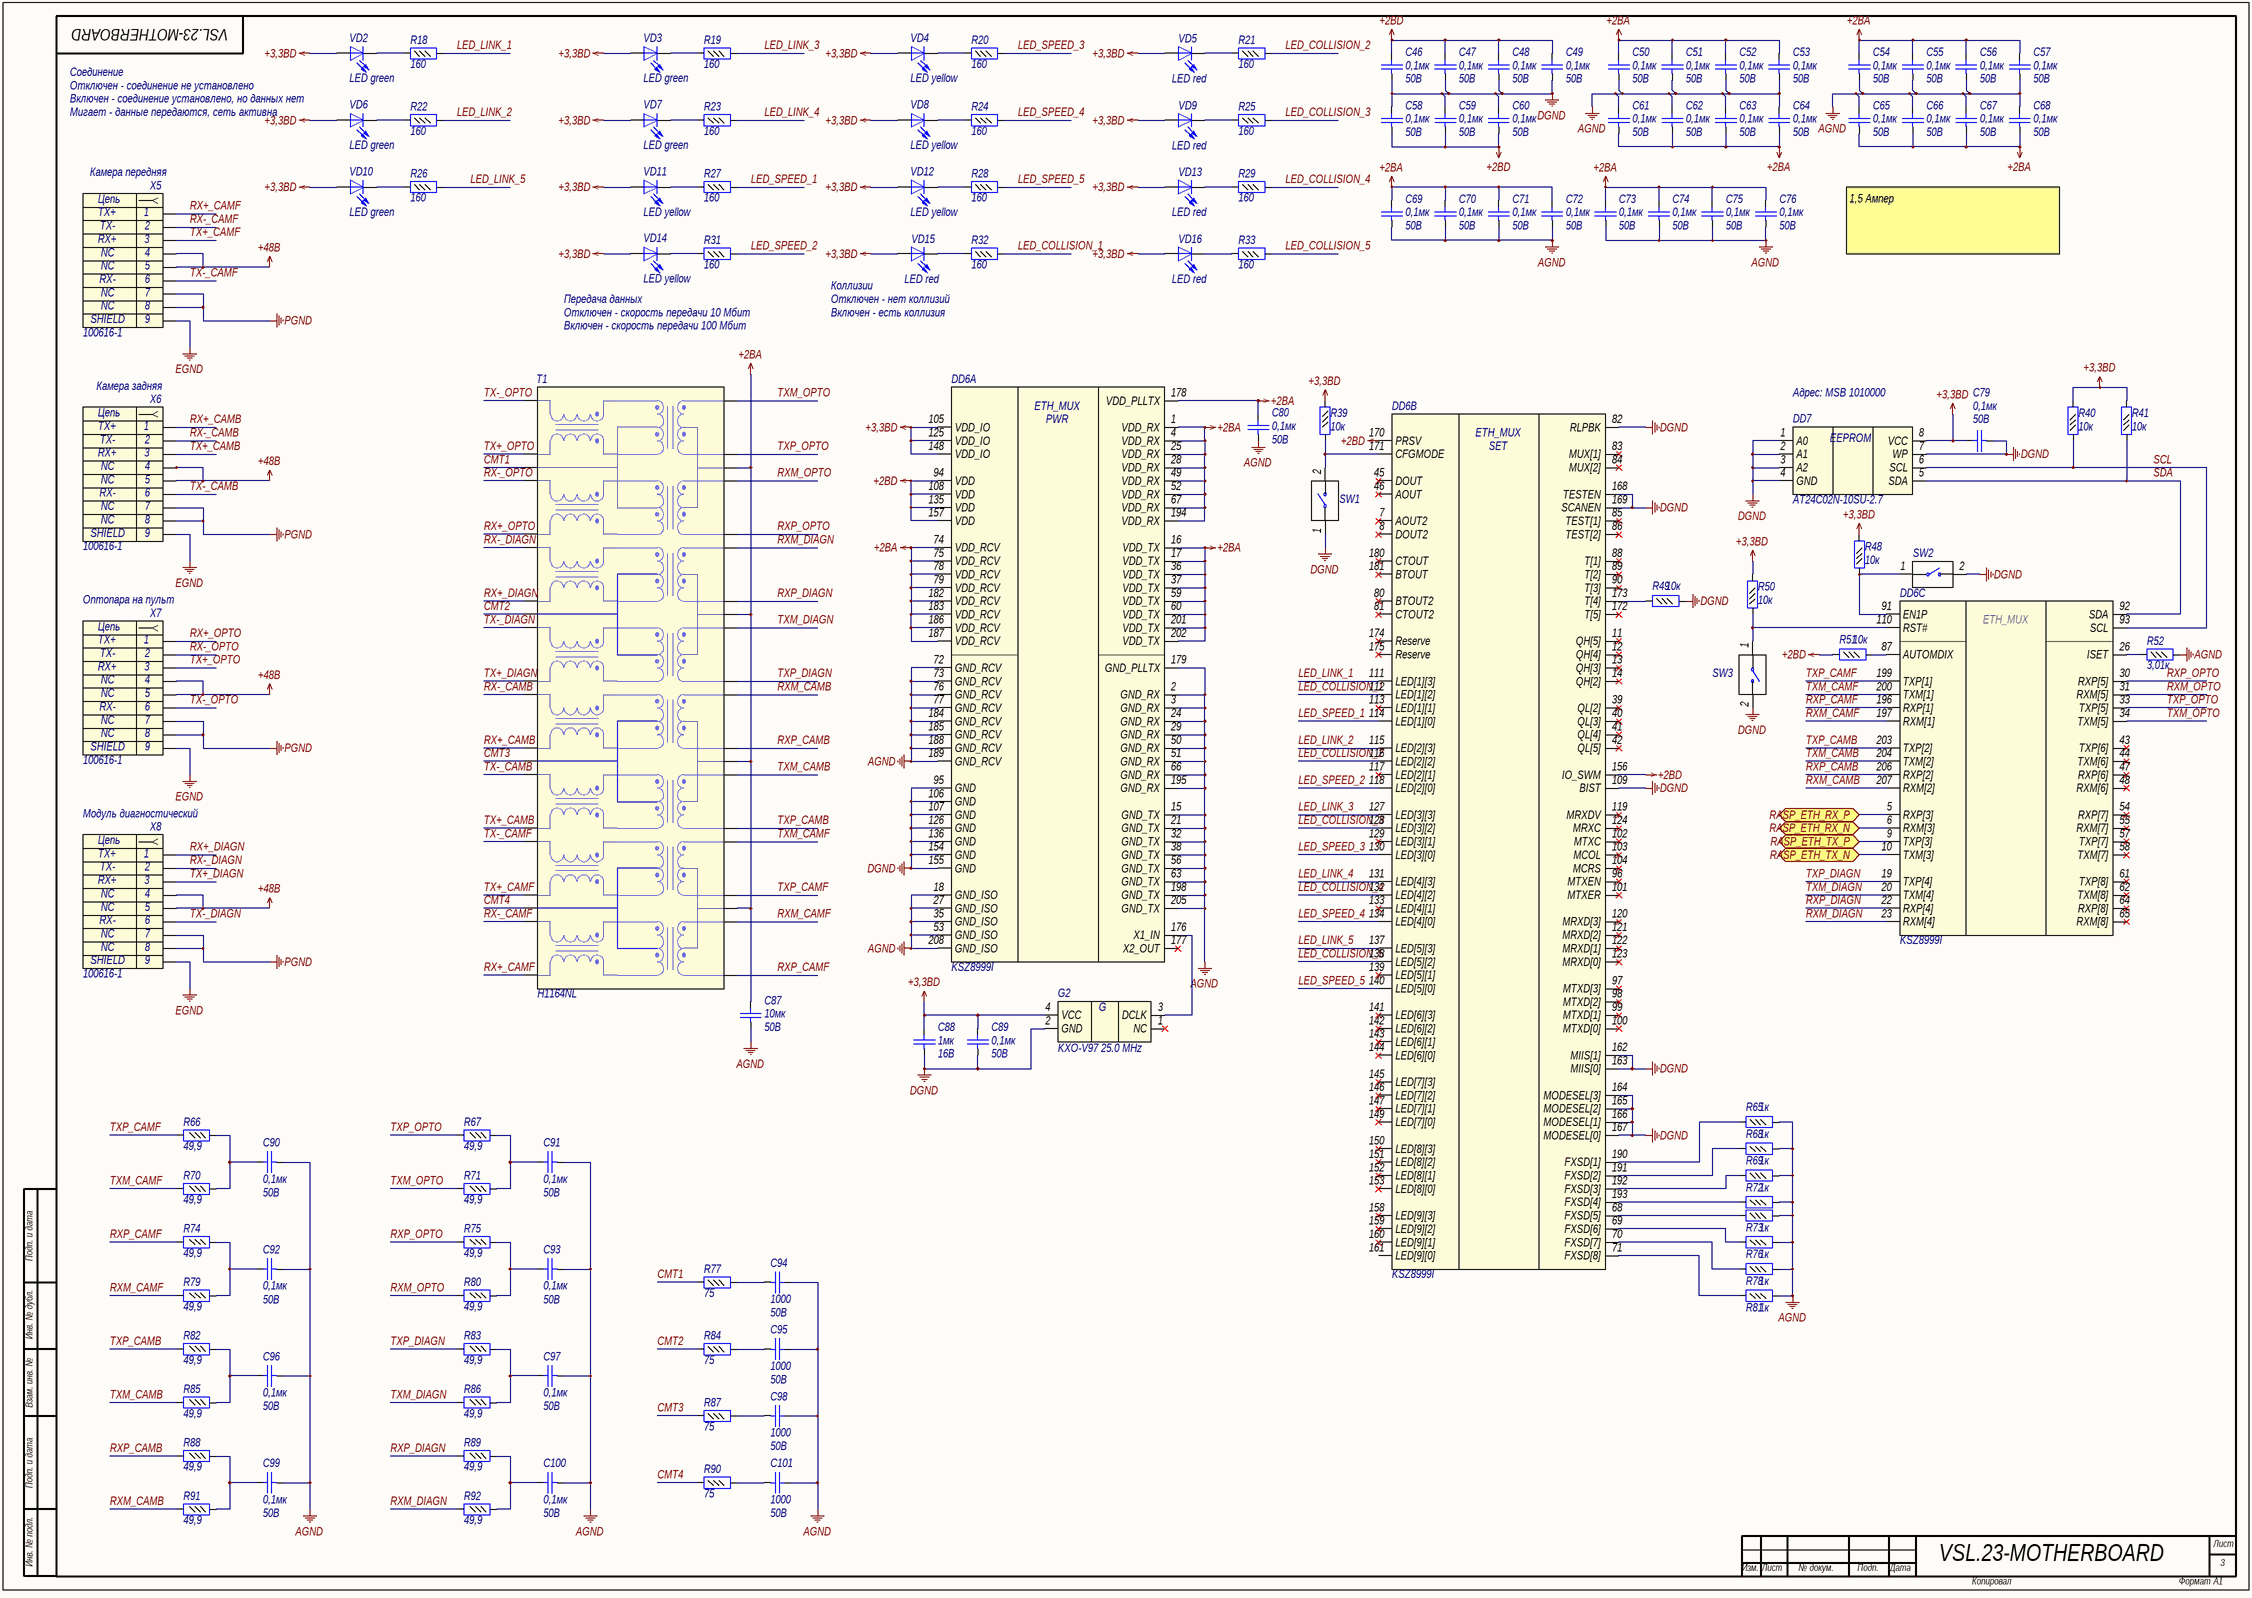
[diagram p2: MainBoard_ETH.SchDoc]

### Parts
C46  value 0,1мк  Voltage: 50В  [C0402]  (hidden comment: Capacitor)
C47  value 0,1мк  Voltage: 50В  [C0402]  (hidden comment: Capacitor)
C48  value 0,1мк  Voltage: 50В  [C0402]  (hidden comment: Capacitor)
C49  value 0,1мк  Voltage: 50В  [C0402]  (hidden comment: Capacitor)
C50  value 0,1мк  Voltage: 50В  [C0402]  (hidden comment: Capacitor)
C51  value 0,1мк  Voltage: 50В  [C0402]  (hidden comment: Capacitor)
C52  value 0,1мк  Voltage: 50В  [C0402]  (hidden comment: Capacitor)
C53  value 0,1мк  Voltage: 50В  [C0402]  (hidden comment: Capacitor)
C54  value 0,1мк  Voltage: 50В  [C0402]  (hidden comment: Capacitor)
C55  value 0,1мк  Voltage: 50В  [C0402]  (hidden comment: Capacitor)
C56  value 0,1мк  Voltage: 50В  [C0402]  (hidden comment: Capacitor)
C57  value 0,1мк  Voltage: 50В  [C0402]  (hidden comment: Capacitor)
C58  value 0,1мк  Voltage: 50В  [C0402]  (hidden comment: Capacitor)
C59  value 0,1мк  Voltage: 50В  [C0402]  (hidden comment: Capacitor)
C60  value 0,1мк  Voltage: 50В  [C0402]  (hidden comment: Capacitor)
C61  value 0,1мк  Voltage: 50В  [C0402]  (hidden comment: Capacitor)
C62  value 0,1мк  Voltage: 50В  [C0402]  (hidden comment: Capacitor)
C63  value 0,1мк  Voltage: 50В  [C0402]  (hidden comment: Capacitor)
C64  value 0,1мк  Voltage: 50В  [C0402]  (hidden comment: Capacitor)
C65  value 0,1мк  Voltage: 50В  [C0402]  (hidden comment: Capacitor)
C66  value 0,1мк  Voltage: 50В  [C0402]  (hidden comment: Capacitor)
C67  value 0,1мк  Voltage: 50В  [C0402]  (hidden comment: Capacitor)
C68  value 0,1мк  Voltage: 50В  [C0402]  (hidden comment: Capacitor)
C69  value 0,1мк  Voltage: 50В  [C0402]  (hidden comment: Capacitor)
C70  value 0,1мк  Voltage: 50В  [C0402]  (hidden comment: Capacitor)
C71  value 0,1мк  Voltage: 50В  [C0402]  (hidden comment: Capacitor)
C72  value 0,1мк  Voltage: 50В  [C0402]  (hidden comment: Capacitor)
C73  value 0,1мк  Voltage: 50В  [C0402]  (hidden comment: Capacitor)
C74  value 0,1мк  Voltage: 50В  [C0402]  (hidden comment: Capacitor)
C75  value 0,1мк  Voltage: 50В  [C0402]  (hidden comment: Capacitor)
C76  value 0,1мк  Voltage: 50В  [C0402]  (hidden comment: Capacitor)
C79  value 0,1мк  Voltage: 50В  [C0402]  (hidden comment: Capacitor)
C80  value 0,1мк  Voltage: 50В  [C0402]  (hidden comment: Capacitor)
C87  Voltage: 50В  [C1210]  (hidden comment: 10мк)
C88  value 1мк  Voltage: 16B  [C0603]  (hidden comment: Capacitor)
C89  value 0,1мк  Voltage: 50В  [C0402]  (hidden comment: Capacitor)
C90  value 0,1мк  Voltage: 50В  [C0402]  (hidden comment: Capacitor)
C91  value 0,1мк  Voltage: 50В  [C0402]  (hidden comment: Capacitor)
C92  value 0,1мк  Voltage: 50В  [C0402]  (hidden comment: Capacitor)
C93  value 0,1мк  Voltage: 50В  [C0402]  (hidden comment: Capacitor)
C94  Voltage: 50B  [C0402]  (hidden comment: 1000)
C95  Voltage: 50B  [C0402]  (hidden comment: 1000)
C96  value 0,1мк  Voltage: 50В  [C0402]  (hidden comment: Capacitor)
C97  value 0,1мк  Voltage: 50В  [C0402]  (hidden comment: Capacitor)
C98  Voltage: 50B  [C0402]  (hidden comment: 1000)
C99  value 0,1мк  Voltage: 50В  [C0402]  (hidden comment: Capacitor)
C100  value 0,1мк  Voltage: 50В  [C0402]  (hidden comment: Capacitor)
C101  Voltage: 50B  [C0402]  (hidden comment: 1000)
DD6  Part Number: KSZ8999I  [PQFP208]  (parts A,B,C of 3)
DD7  Part Number: AT24C02N-10SU-2.7  [SO8]  (hidden comment: AT24C0x)
G2  Part Number: KXO-V97 25.0 MHz  [QSMD7x5.2x1.8]  (hidden comment: KXO)
R18  value 160  [R0402]  (hidden comment: Resistor_0,062Вт)
R19  value 160  [R0402]  (hidden comment: Resistor_0,062Вт)
R20  value 160  [R0402]  (hidden comment: Resistor_0,062Вт)
R21  value 160  [R0402]  (hidden comment: Resistor_0,062Вт)
R22  value 160  [R0402]  (hidden comment: Resistor_0,062Вт)
R23  value 160  [R0402]  (hidden comment: Resistor_0,062Вт)
R24  value 160  [R0402]  (hidden comment: Resistor_0,062Вт)
R25  value 160  [R0402]  (hidden comment: Resistor_0,062Вт)
R26  value 160  [R0402]  (hidden comment: Resistor_0,062Вт)
R27  value 160  [R0402]  (hidden comment: Resistor_0,062Вт)
R28  value 160  [R0402]  (hidden comment: Resistor_0,062Вт)
R29  value 160  [R0402]  (hidden comment: Resistor_0,062Вт)
R31  value 160  [R0402]  (hidden comment: Resistor_0,062Вт)
R32  value 160  [R0402]  (hidden comment: Resistor_0,062Вт)
R33  value 160  [R0402]  (hidden comment: Resistor_0,062Вт)
R39  value 10к  [R0402]  (hidden comment: Resistor_0,062Вт)
R40  value 10к  [R0402]  (hidden comment: Resistor_0,062Вт)
R41  value 10к  [R0402]  (hidden comment: Resistor_0,062Вт)
R48  value 10к  [R0402]  (hidden comment: Resistor_0,062Вт)
R49  value 10к  [R0402]  (hidden comment: Resistor_0,062Вт)
R50  value 10к  [R0402]  (hidden comment: Resistor_0,062Вт)
R51  value 10к  [R0402]  (hidden comment: Resistor_0,062Вт)
R52  value 3,01к  [R0402]  (hidden comment: Resistor_0,062Вт)
R65  value 1к  [R0402]  (hidden comment: Resistor_0,062Вт)
R66  value 49,9  [R0402]  (hidden comment: Resistor_0,062Вт)
R67  value 49,9  [R0402]  (hidden comment: Resistor_0,062Вт)
R68  value 1к  [R0402]  (hidden comment: Resistor_0,062Вт)
R69  value 1к  [R0402]  (hidden comment: Resistor_0,062Вт)
R70  value 49,9  [R0402]  (hidden comment: Resistor_0,062Вт)
R71  value 49,9  [R0402]  (hidden comment: Resistor_0,062Вт)
R72  value 1к  [R0402]  (hidden comment: Resistor_0,062Вт)
R73  value 1к  [R0402]  (hidden comment: Resistor_0,062Вт)
R74  value 49,9  [R0402]  (hidden comment: Resistor_0,062Вт)
R75  value 49,9  [R0402]  (hidden comment: Resistor_0,062Вт)
R76  value 1к  [R0402]  (hidden comment: Resistor_0,062Вт)
R77  value 75  [R0402]  (hidden comment: Resistor_0,062Вт)
R78  value 1к  [R0402]  (hidden comment: Resistor_0,062Вт)
R79  value 49,9  [R0402]  (hidden comment: Resistor_0,062Вт)
R80  value 49,9  [R0402]  (hidden comment: Resistor_0,062Вт)
R81  value 1к  [R0402]  (hidden comment: Resistor_0,062Вт)
R82  value 49,9  [R0402]  (hidden comment: Resistor_0,062Вт)
R83  value 49,9  [R0402]  (hidden comment: Resistor_0,062Вт)
R84  value 75  [R0402]  (hidden comment: Resistor_0,062Вт)
R85  value 49,9  [R0402]  (hidden comment: Resistor_0,062Вт)
R86  value 49,9  [R0402]  (hidden comment: Resistor_0,062Вт)
R87  value 75  [R0402]  (hidden comment: Resistor_0,062Вт)
R88  value 49,9  [R0402]  (hidden comment: Resistor_0,062Вт)
R89  value 49,9  [R0402]  (hidden comment: Resistor_0,062Вт)
R90  value 75  [R0402]  (hidden comment: Resistor_0,062Вт)
R91  value 49,9  [R0402]  (hidden comment: Resistor_0,062Вт)
R92  value 49,9  [R0402]  (hidden comment: Resistor_0,062Вт)
SW1  DS1040-01  [JUMPER_2.54]  (value not drawn)
SW2  DS1040-01  [1PAD_ADR]  (value not drawn)
SW3  DS1040-01  [JUMPER_2.54]  (value not drawn)
T1  Part Number: H1164NL  [H1164NL_TRANS]  (hidden comment: ETH Trasformer)
VD2  Part Name: LED green  [L_0402_GREEN]  (hidden comment: LED)
VD3  Part Name: LED green  [L_0402_GREEN]  (hidden comment: LED)
VD4  Part Name: LED yellow  [L_0402_YELLOW]  (hidden comment: LED)
VD5  Part Name: LED red  [L_0402_RED]  (hidden comment: LED)
VD6  Part Name: LED green  [L_0402_GREEN]  (hidden comment: LED)
VD7  Part Name: LED green  [L_0402_GREEN]  (hidden comment: LED)
VD8  Part Name: LED yellow  [L_0402_YELLOW]  (hidden comment: LED)
VD9  Part Name: LED red  [L_0402_RED]  (hidden comment: LED)
VD10  Part Name: LED green  [L_0402_GREEN]  (hidden comment: LED)
VD11  Part Name: LED yellow  [L_0402_YELLOW]  (hidden comment: LED)
VD12  Part Name: LED yellow  [L_0402_YELLOW]  (hidden comment: LED)
VD13  Part Name: LED red  [L_0402_RED]  (hidden comment: LED)
VD14  Part Name: LED yellow  [L_0402_YELLOW]  (hidden comment: LED)
VD15  Part Name: LED red  [L_0402_RED]  (hidden comment: LED)
VD16  Part Name: LED red  [L_0402_RED]  (hidden comment: LED)
X5  Камера передняя  Part Number: 100616-1  [RJ45_100616-1]
X6  Камера задняя  Part Number: 100616-1  [RJ45_100616-1]
X7  Оптопара на пульт  Part Number: 100616-1  [RJ45_100616-1]
X8  Модуль диагностический  Part Number: 100616-1  [RJ45_100616-1]

### Ports
RASP_ETH_RX_N, RASP_ETH_RX_P, RASP_ETH_TX_N, RASP_ETH_TX_P

### Nets
+2BA: C50.2 C51.2 C52.2 C53.2 C54.2 C55.2 C56.2 C57.2 C61.1 C62.1 C63.1 C64.1 C65.1 C66.1 C67.1 C68.1 C69.2 C70.2 C71.2 C72.2 C73.2 C74.2 C75.2 C76.2 C80.2 C87.2 DD6.1(VDD_RX) DD6.4(VDD_RX) DD6.16(VDD_TX) DD6.17(VDD_TX) DD6.25(VDD_RX) DD6.28(VDD_RX) DD6.36(VDD_TX) DD6.37(VDD_TX) DD6.49(VDD_RX) DD6.52(VDD_RX) DD6.59(VDD_TX) DD6.60(VDD_TX) DD6.67(VDD_RX) DD6.74(VDD_RCV) DD6.75(VDD_RCV) DD6.78(VDD_RCV) DD6.79(VDD_RCV) DD6.178(VDD_PLLTX) DD6.182(VDD_RCV) DD6.183(VDD_RCV) DD6.186(VDD_RCV) DD6.187(VDD_RCV) DD6.194(VDD_RX) DD6.201(VDD_TX) DD6.202(VDD_TX) T1.3(CT4) T1.8(CT3) T1.13(CT2) T1.18(CT1)
+2BD: C46.2 C47.2 C48.2 C49.2 C58.1 C59.1 C60.1 DD6.94(VDD) DD6.108(VDD) DD6.135(VDD) DD6.156(IO_SWM) DD6.157(VDD) DD6.170(PRSV) R51.1
+3,3BD: C79.2 C88.2 C89.2 DD6.105(VDD_IO) DD6.125(VDD_IO) DD6.148(VDD_IO) DD7.8(VCC) G2.4(VCC) R39.1 R40.2 R41.2 R48.2 R50.2 VD2.2(A) VD3.2(A) VD4.2(A) VD5.2(A) VD6.2(A) VD7.2(A) VD8.2(A) VD9.2(A) VD10.2(A) VD11.2(A) VD12.2(A) VD13.2(A) VD14.2(A) VD15.2(A) VD16.2(A)
+48B: X5.4 X5.5 X6.4 X6.5 X7.4 X7.5 X8.4 X8.5
AGND: C50.1 C51.1 C52.1 C53.1 C54.1 C55.1 C56.1 C57.1 C61.2 C62.2 C63.2 C64.2 C65.2 C66.2 C67.2 C68.2 C69.1 C70.1 C71.1 C72.1 C73.1 C74.1 C75.1 C76.1 C80.1 C87.1 C90.1 C91.1 C92.1 C93.1 C94.2 C95.2 C96.1 C97.1 C98.2 C99.1 C100.1 C101.2 DD6.2(GND_RX) DD6.3(GND_RX) DD6.15(GND_TX) DD6.18(GND_ISO) DD6.21(GND_TX) DD6.24(GND_RX) DD6.27(GND_ISO) DD6.29(GND_RX) DD6.32(GND_TX) DD6.35(GND_ISO) DD6.38(GND_TX) DD6.50(GND_RX) DD6.51(GND_RX) DD6.53(GND_ISO) DD6.56(GND_TX) DD6.63(GND_TX) DD6.66(GND_RX) DD6.72(GND_RCV) DD6.73(GND_RCV) DD6.76(GND_RCV) DD6.77(GND_RCV) DD6.179(GND_PLLTX) DD6.184(GND_RCV) DD6.185(GND_RCV) DD6.188(GND_RCV) DD6.189(GND_RCV) DD6.195(GND_RX) DD6.198(GND_TX) DD6.205(GND_TX) DD6.208(GND_ISO) R52.2 R65.2 R68.2 R69.2 R72.2 R73.2 R76.2 R78.2 R81.2
DGND: C46.1 C47.1 C48.1 C49.1 C58.2 C59.2 C60.2 C79.1 C88.1 C89.1 DD6.82(RLPBK) DD6.95(GND) DD6.106(GND) DD6.107(GND) DD6.109(BIST) DD6.126(GND) DD6.136(GND) DD6.154(GND) DD6.155(GND) DD6.162(MIIS[1]) DD6.163(MIIS[0]) DD6.164(MODESEL[3]) DD6.165(MODESEL[2]) DD6.166(MODESEL[1]) DD6.167(MODESEL[0]) DD6.168(TESTEN) DD6.169(SCANEN) DD7.1(A0) DD7.2(A1) DD7.3(A2) DD7.4(GND) DD7.7(WP) G2.2(GND) R49.2 SW1.1 SW2.2 SW3.2
EGND: X5.9 X6.9 X7.9 X8.9
PGND: X5.7 X5.8 X6.7 X6.8 X7.7 X7.8 X8.7 X8.8
CMT1: R77.1 T1.38(CMGND)
CMT2: R84.1 T1.33(CMGND)
CMT3: R87.1 T1.28(CMGND)
CMT4: R90.1 T1.23(CMGND)
LED_COLLISION_1: DD6.112(LED[1][2]) R32.2
LED_COLLISION_2: DD6.116(LED[2][2]) R21.2
LED_COLLISION_3: DD6.128(LED[3][2]) R25.2
LED_COLLISION_4: DD6.132(LED[4][2]) R29.2
LED_COLLISION_5: DD6.138(LED[5][2]) R33.2
LED_LINK_1: DD6.111(LED[1][3]) R18.2
LED_LINK_2: DD6.115(LED[2][3]) R22.2
LED_LINK_3: DD6.127(LED[3][3]) R19.2
LED_LINK_4: DD6.131(LED[4][3]) R23.2
LED_LINK_5: DD6.137(LED[5][3]) R26.2
LED_SPEED_1: DD6.114(LED[1][0]) R27.2
LED_SPEED_2: DD6.118(LED[2][0]) R31.2
LED_SPEED_3: DD6.130(LED[3][0]) R20.2
LED_SPEED_4: DD6.134(LED[4][0]) R24.2
LED_SPEED_5: DD6.140(LED[5][0]) R28.2
RX+_CAMB: T1.29(TX2-) X6.1
RX+_CAMF: T1.21(TX1+) X5.1
RX+_DIAGN: T1.34(RX3+) X8.1
RX+_OPTO: T1.36(RX4-) X7.1
RX-_CAMB: T1.30(TX2+) X6.2
RX-_CAMF: T1.22(TX1-) X5.2
RX-_DIAGN: T1.35(RX3-) X8.2
RX-_OPTO: T1.37(RX4+) X7.2
RXM_CAMB: DD6.207(RXM[2]) R91.2 T1.11(TD2+)
RXM_CAMF: DD6.197(RXM[1]) R79.2 T1.19(TD1-)
RXM_DIAGN: DD6.23(RXM[4]) R92.2 T1.6(RD3-)
RXM_OPTO: DD6.31(RXM[5]) R80.2 T1.4(RD4+)
RXP_CAMB: DD6.206(RXP[2]) R88.2 T1.12(TD2-)
RXP_CAMF: DD6.196(RXP[1]) R74.2 T1.20(TD1+)
RXP_DIAGN: DD6.22(RXP[4]) R89.2 T1.7(RD3+)
RXP_OPTO: DD6.30(RXP[5]) R75.2 T1.5(RD4-)
SCL: DD6.93(SCL) DD7.6(SCL) R40.1
SDA: DD6.92(SDA) DD7.5(SDA) R41.1
TX+_CAMB: T1.26(RX2-) X6.3
TX+_CAMF: T1.24(RX1+) X5.3
TX+_DIAGN: T1.31(TX3+) X8.3
TX+_OPTO: T1.39(TX4-) X7.3
TX-_CAMB: T1.27(RX2+) X6.6
TX-_CAMF: T1.25(RX1-) X5.6
TX-_DIAGN: T1.32(TX3-) X8.6
TX-_OPTO: T1.40(TX4+) X7.6
TXM_CAMB: DD6.204(TXM[2]) R85.2 T1.14(RD2+)
TXM_CAMF: DD6.200(TXM[1]) R70.2 T1.16(RD1-)
TXM_DIAGN: DD6.20(TXM[4]) R86.2 T1.9(TD3-)
TXM_OPTO: DD6.34(TXM[5]) R71.2 T1.1(TD4+)
TXP_CAMB: DD6.203(TXP[2]) R82.2 T1.15(RD2-)
TXP_CAMF: DD6.199(TXP[1]) R66.2 T1.17(RD1+)
TXP_DIAGN: DD6.19(TXP[4]) R83.2 T1.10(TD3+)
TXP_OPTO: DD6.33(TXP[5]) R67.2 T1.2(TD4-)
NetC90_2: C90.2 R66.1 R70.1
NetC91_2: C91.2 R67.1 R71.1
NetC92_2: C92.2 R74.1 R79.1
NetC93_2: C93.2 R75.1 R80.1
NetC94_1: C94.1 R77.2
NetC95_1: C95.1 R84.2
NetC96_2: C96.2 R82.1 R85.1
NetC97_2: C97.2 R83.1 R86.1
NetC98_1: C98.1 R87.2
NetC99_2: C99.2 R88.1 R91.1
NetC100_2: C100.2 R89.1 R92.1
NetC101_1: C101.1 R90.2
NetDD6_5: DD6.5(RXP[3]) ; port RASP_ETH_RX_P
NetDD6_6: DD6.6(RXM[3]) ; port RASP_ETH_RX_N
NetDD6_9: DD6.9(TXP[3]) ; port RASP_ETH_TX_P
NetDD6_10: DD6.10(TXM[3]) ; port RASP_ETH_TX_N
NetDD6_26: DD6.26(ISET) R52.1
NetDD6_68: DD6.68(FXSD[5]) R73.1
NetDD6_69: DD6.69(FXSD[6]) R76.1
NetDD6_70: DD6.70(FXSD[7]) R78.1
NetDD6_71: DD6.71(FXSD[8]) R81.1
NetDD6_87: DD6.87(AUTOMDIX) R51.2
NetDD6_91: DD6.91(EN1P) R48.1 SW2.1
NetDD6_110: DD6.110(RST#) R50.1 SW3.1
NetDD6_171: DD6.171(CFGMODE) R39.2 SW1.2
NetDD6_173: DD6.173(T[4]) R49.1
NetDD6_176: DD6.176(X1_IN) G2.3(DCLK)
NetDD6_190: DD6.190(FXSD[1]) R65.1
NetDD6_191: DD6.191(FXSD[2]) R68.1
NetDD6_192: DD6.192(FXSD[3]) R69.1
NetDD6_193: DD6.193(FXSD[4]) R72.1
NetR18_1: R18.1 VD2.1(K)
NetR19_1: R19.1 VD3.1(K)
NetR20_1: R20.1 VD4.1(K)
NetR21_1: R21.1 VD5.1(K)
NetR22_1: R22.1 VD6.1(K)
NetR23_1: R23.1 VD7.1(K)
NetR24_1: R24.1 VD8.1(K)
NetR25_1: R25.1 VD9.1(K)
NetR26_1: R26.1 VD10.1(K)
NetR27_1: R27.1 VD11.1(K)
NetR28_1: R28.1 VD12.1(K)
NetR29_1: R29.1 VD13.1(K)
NetR31_1: R31.1 VD14.1(K)
NetR32_1: R32.1 VD15.1(K)
NetR33_1: R33.1 VD16.1(K)

Not connected (* = marked no-connect by the designer): DD6 7(AOUT2)* 8(DOUT2)* 11(QH[5])* 12(QH[4])* 13(QH[3])* 14(QH[2])* 39(QL[2])* 40(QL[3])* 41(QL[4])* 42(QL[5])* 43(TXP[6])* 44(TXM[6])* 45(DOUT)* 46(AOUT)* 47(RXP[6])* 48(RXM[6])* 54(RXP[7])* 55(RXM[7])* 57(TXP[7])* 58(TXM[7])* 61(TXP[8])* 62(TXM[8])* 64(RXP[8])* 65(RXM[8])* 80(BTOUT2)* 81(CTOUT2)* 83(MUX[1])* 84(MUX[2])* 85(TEST[1])* 86(TEST[2])* 88(T[1])* 89(T[2])* 90(T[3])* 96(MTXEN)* 97(MTXD[3])* 98(MTXD[2])* 99(MTXD[1])* 100(MTXD[0])* 101(MTXER)* 102(MTXC)* 103(MCOL)* 104(MCRS)* 113(LED[1][1])* 117(LED[2][1])* 119(MRXDV)* 120(MRXD[3])* 121(MRXD[2])* 122(MRXD[1])* 123(MRXD[0])* 124(MRXC)* 129(LED[3][1])* 133(LED[4][1])* 139(LED[5][1])* 141(LED[6][3])* 142(LED[6][2])* 143(LED[6][1])* 144(LED[6][0])* 145(LED[7][3])* 146(LED[7][2])* 147(LED[7][1])* 149(LED[7][0])* 150(LED[8][3])* 151(LED[8][2])* 152(LED[8][1])* 153(LED[8][0])* 158(LED[9][3])* 159(LED[9][2])* 160(LED[9][1])* 161(LED[9][0]) 172(T[5])* 174(Reserve)* 175(Reserve)* 177(X2_OUT)* 180(CTOUT)* 181(BTOUT)*; G2 1(NC)*

### Notes on the sheet
- Соединение
- Отключен - соединение не установлено
- (near VD6) Включен - соединение установлено, но данных нет
- Мигает - данные передаются, сеть активна
- 1,5 Ампер
- Передача данных
- Коллизии
- Отключен - нет коллизий
- Отключен - скорость передачи 10 Мбит
- Включен - скорость передачи 100 Мбит
- Включен - есть коллизия
- Адрес: MSB 1010000
- Подп. и дата
- Инв. № дубл.
- Взам. инв. №
- Инв. № подл.
- Лист
- Изм.
- № докум.
- Подп.
- Дата
- Копировал
- Формат
- (in symbol connect111) Цепь
- (in symbol crystal9) G
- (in symbol interf24, part A) ETH_MUX; PWR
- (in symbol interf24, part B) ETH_MUX; SET
- (in symbol interf24, part C) ETH_MUX

### Library data of the parts
C46-C76 C79 C80 C89-C93 C96 C97 C99 C100 = cap277: as C3 on sheet MainBoard_MCU
C87 = cap297: as C8 on sheet MainBoard_MCU; Value: 10мк
C88 = cap133: as C4 on sheet MainBoard_MCU
C94 C95 C98 C101 = cap31: Конденсатор; Part Name: Ceramic; Manufacture: Murata; Part Number: GRM155R71H102K*; id: cap31; TKE: X7R; Value: 1000
DD6 = interf24: 9-Port 10/100 Unmanaged Ethernet Switch; Manufacture: Microchip; Type Supply: Single Polar; Current Consumption: 4,34A; Power Supply: 2 В; id: interf24; Part Name: 9-Port 10/100 Unmanaged Ethernet Switch
DD7 = AT24C02N-10SU-2.7: Two-wire  Serial EEPROM; Manufacturer: Microchip; id: mem2; Frequency: 400kHz; Access Time: 900ns; Write Time: 5ms; Memory Size: 2Kbit; Interface: i2c; Power Supply: 2.7-5.5 V; Part Name: EEPROM
G2 = crystal9: Кварц. генер. 32.768 МГц (HCMOS/TTL); Manufacture: GEYER; Frequence: 25MHz; Power Supply: 3,3B; Tempreture MIN: -20°С; Tempreture MAX: +70°С; id: crystal9
R18-R29 R31-R33 = res251: Резистор; Manufacture: Yageo; Part Number: RC0402FR-07160RL; id: res251; Accuracy: 0,01; Part Name: Resistor; Power: 0,062Вт
R39-R41 R48-R51 = res294: as R1 on sheet MainBoard_MCU; Part Name: Resistor; Power: 0,062Вт
R52 = res1212: Резистор; Manufacture: Yageo; Part Number: RC0402FR-073K01L; Accuracy: 0,01; id: res1212; Part Name: Resistor; Power: 0,062Вт
R65 R68 R69 R72 R73 R76 R78 R81 = res270: Резистор; Manufacture: Yageo; Part Number: RC0402FR-071KL; id: res270; Accuracy: 0,01; Part Name: Resistor; Power: 0,062Вт
R66 R67 R70 R71 R74 R75 R79 R80 R82 R83 R85 R86 R88 R89 R91 R92 = res984: Резистор; Manufacture: Yageo; Part Number: RC0402FR-0749R9L; id: res984; Accuracy: 0,01; Part Name: Resistor; Power: 0,062Вт
R77 R84 R87 R90 = res243: Резистор; Manufacture: Yageo; Part Number: RC0402FR-0775RL; id: res243; Accuracy: 0,01; Part Name: Resistor; Power: 0,062Вт
SW1 SW3 = btn9: DIP переключатель; Part Name: Перемычка адреса; id: btn9; Etch: 2,54
SW2 = btn7: DIP переключатель; Part Name: Перемычка адреса; id: btn7
T1 = ind174: EMI Suppression Filter; Part Name: 10/100Base-TX Transformer Modules; Manufacture: Pulse Electronics; id: ind174
VD2 VD3 VD6 VD7 VD10 = diode30: Светодиод; Part Number: KPHHS-1005MGCK; id: diode30
VD4 VD8 VD11 VD12 VD14 = diode29: Светодиод; Part Number: KPHHS-1005SYCK; id: diode29
VD5 VD9 VD13 VD15 VD16 = diode28: Светодиод; Part Number: KPHHS-1005SURCK; id: diode28
X5-X8 = connect111: Разъем - 9 конт. розетка; Part Name: Conn RJ-45 F 8; Manufacture: TE Connectivity; Contact_1: TX+; Contact_2: TX-; Contact_3: RX+; Contact_4: NC; Contact_6: RX-; Etch: 2.54mm; Contact_9: SHIELD; Contact_5: NC; id: connect111; Contact_7: NC; Contact_8: NC

## Sheet MainBoard_ETH_RASP.SchDoc
size 594 x 420 mm; DocumentNumber: VSL.23-MOTHERBOARD; SheetNumber: 4; Format: A2
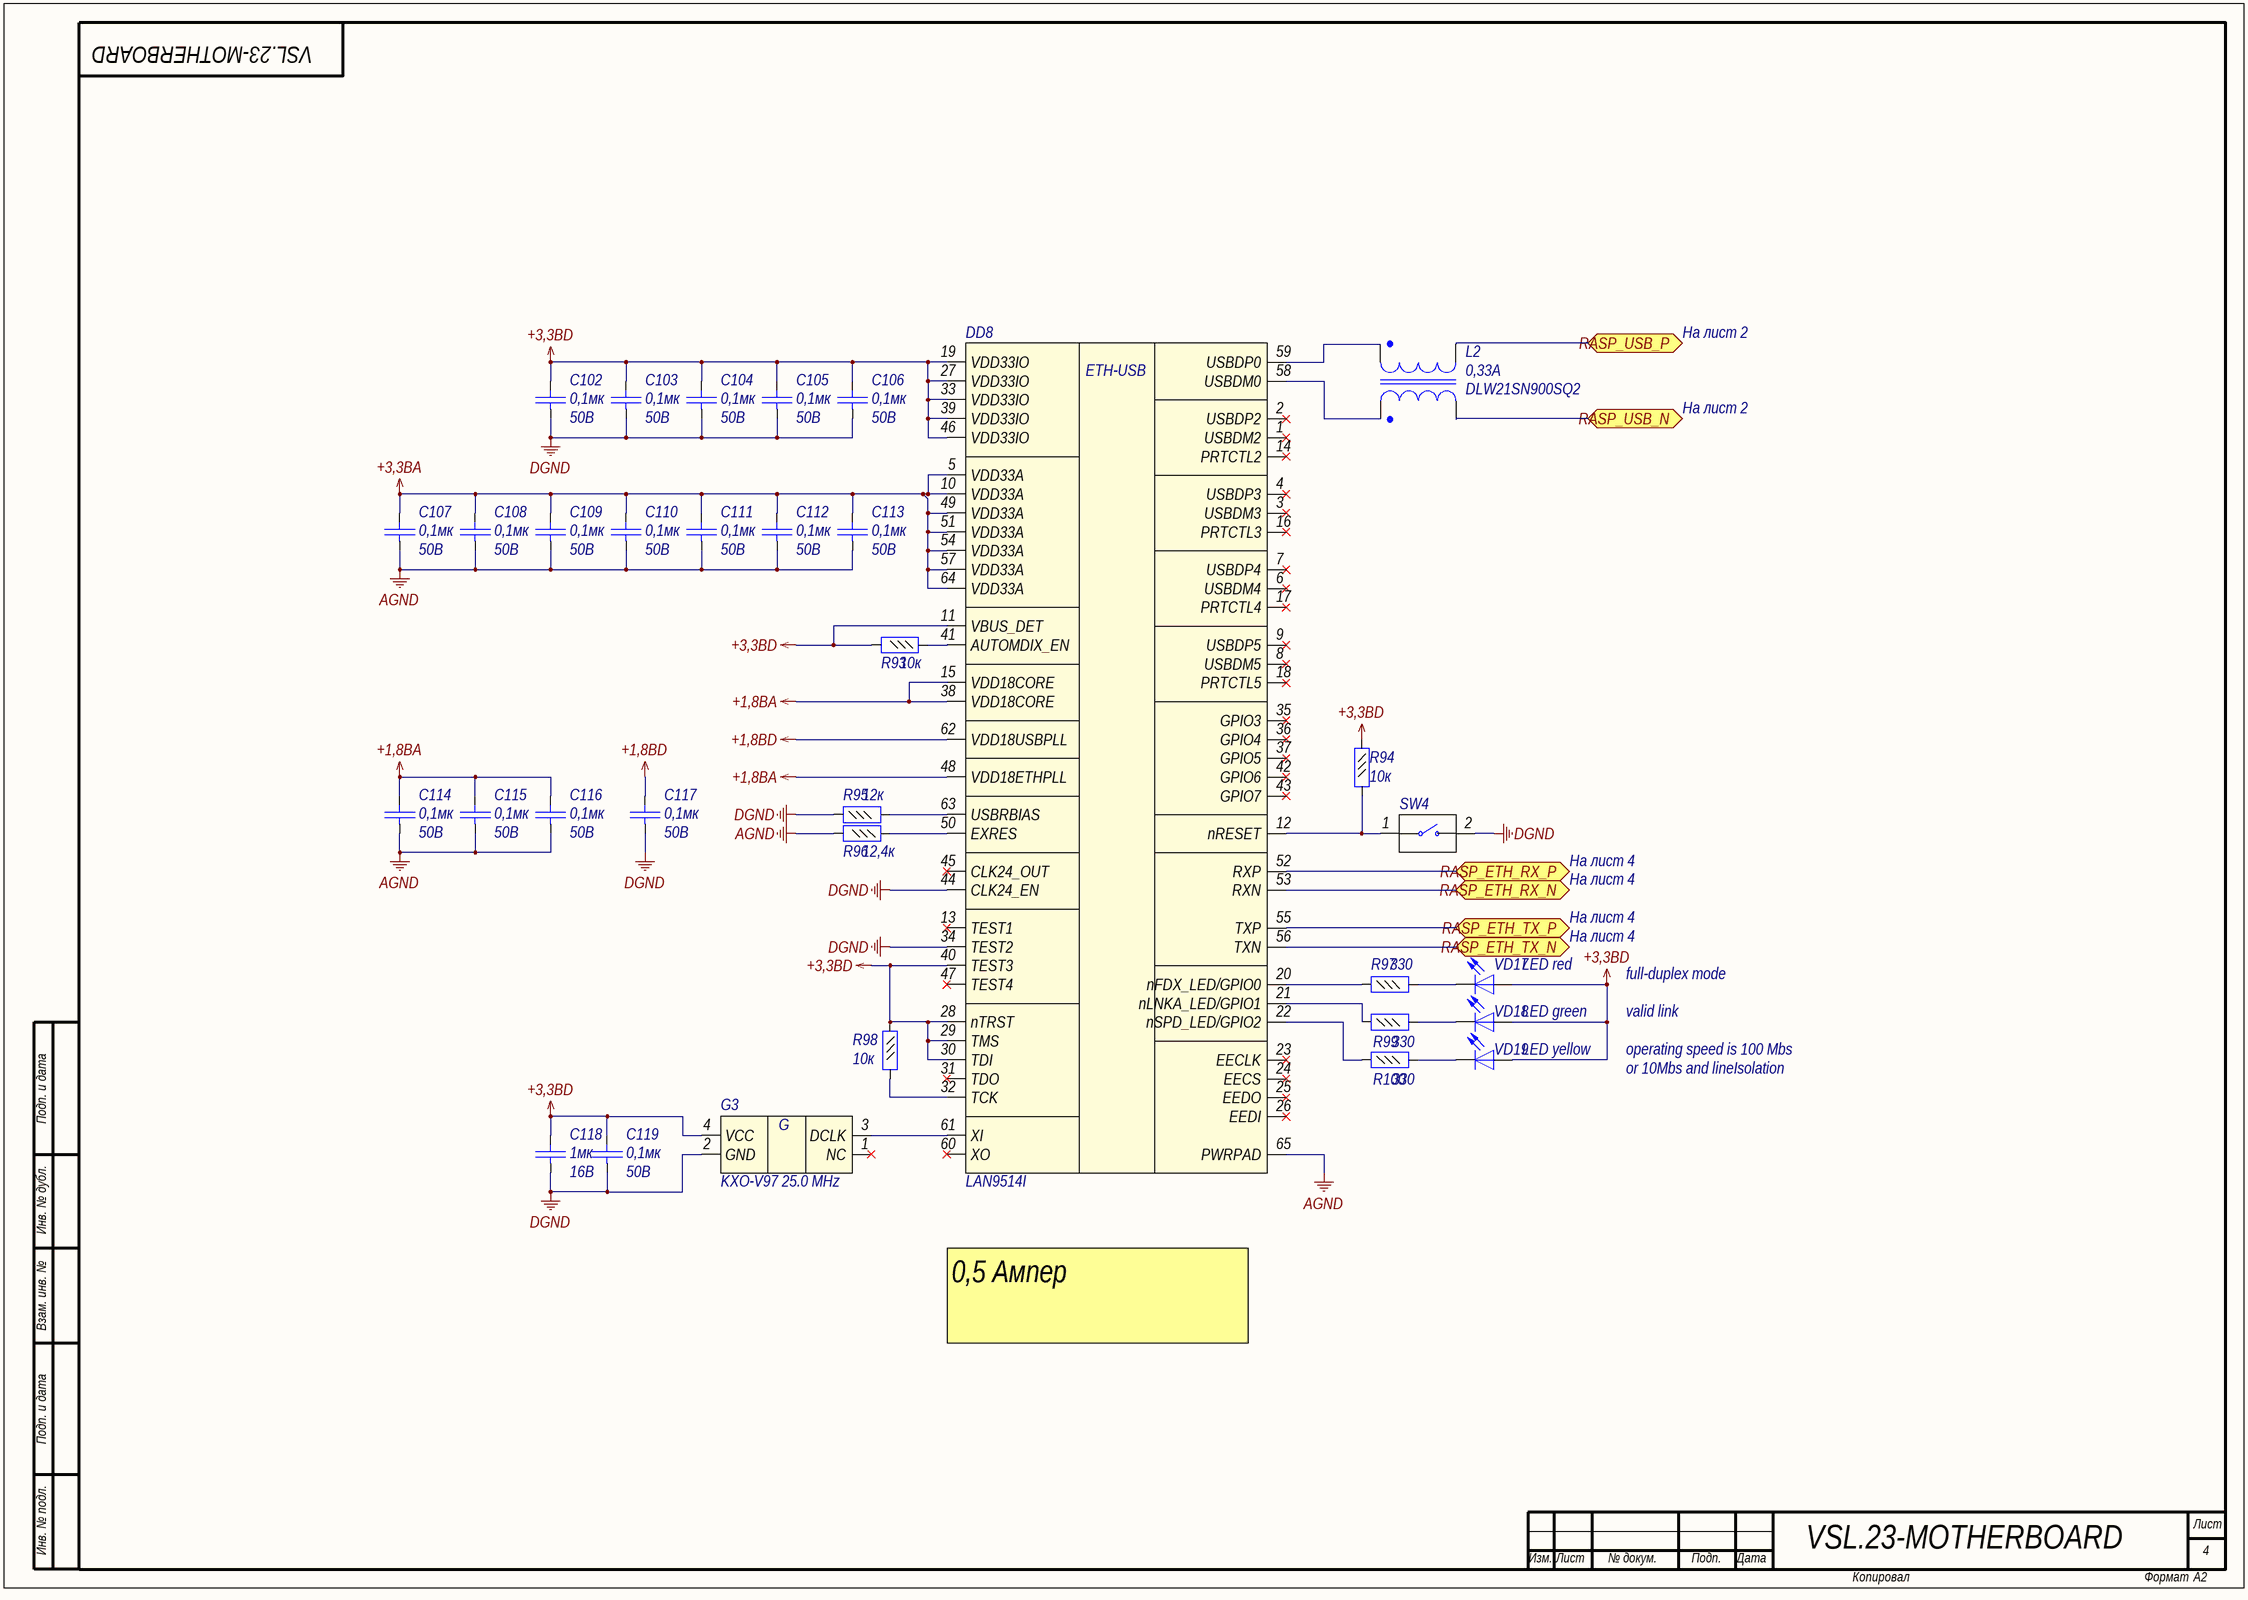
[diagram p3: MainBoard_ETH_RASP.SchDoc]

### Parts
C102  value 0,1мк  Voltage: 50В  [C0402]  (hidden comment: Capacitor)
C103  value 0,1мк  Voltage: 50В  [C0402]  (hidden comment: Capacitor)
C104  value 0,1мк  Voltage: 50В  [C0402]  (hidden comment: Capacitor)
C105  value 0,1мк  Voltage: 50В  [C0402]  (hidden comment: Capacitor)
C106  value 0,1мк  Voltage: 50В  [C0402]  (hidden comment: Capacitor)
C107  value 0,1мк  Voltage: 50В  [C0402]  (hidden comment: Capacitor)
C108  value 0,1мк  Voltage: 50В  [C0402]  (hidden comment: Capacitor)
C109  value 0,1мк  Voltage: 50В  [C0402]  (hidden comment: Capacitor)
C110  value 0,1мк  Voltage: 50В  [C0402]  (hidden comment: Capacitor)
C111  value 0,1мк  Voltage: 50В  [C0402]  (hidden comment: Capacitor)
C112  value 0,1мк  Voltage: 50В  [C0402]  (hidden comment: Capacitor)
C113  value 0,1мк  Voltage: 50В  [C0402]  (hidden comment: Capacitor)
C114  value 0,1мк  Voltage: 50В  [C0402]  (hidden comment: Capacitor)
C115  value 0,1мк  Voltage: 50В  [C0402]  (hidden comment: Capacitor)
C116  value 0,1мк  Voltage: 50В  [C0402]  (hidden comment: Capacitor)
C117  value 0,1мк  Voltage: 50В  [C0402]  (hidden comment: Capacitor)
C118  value 1мк  Voltage: 16B  [C0603]  (hidden comment: Capacitor)
C119  value 0,1мк  Voltage: 50В  [C0402]  (hidden comment: Capacitor)
DD8  (no value)  [QFN64]
G3  Part Number: KXO-V97 25.0 MHz  [QSMD7x5.2x1.8]  (hidden comment: KXO)
L2  Rated Current: 0,33A  Part Number: DLW21SN900SQ2  [CHOKE0805]  (hidden comment: Dual-Winding Inductor)
R93  value 10к  [R0402]  (hidden comment: Resistor_0,062Вт)
R94  value 10к  [R0402]  (hidden comment: Resistor_0,062Вт)
R95  value 12к  [R0402]  (hidden comment: Resistor_0,062Вт)
R96  value 12,4к  [R0402]  (hidden comment: Resistor_0,062Вт)
R97  value 330  [R0402]  (hidden comment: Resistor_0,062Вт)
R98  value 10к  [R0402]  (hidden comment: Resistor_0,062Вт)
R99  value 330  [R0402]  (hidden comment: Resistor_0,062Вт)
R100  value 330  [R0402]  (hidden comment: Resistor_0,062Вт)
SW4  DS1040-01  [JUMPER_2.54]  (value not drawn)
VD17  Part Name: LED red  [L_0402_RED]  (hidden comment: LED)
VD18  Part Name: LED green  [L_0402_GREEN]  (hidden comment: LED)
VD19  Part Name: LED yellow  [L_0402_YELLOW]  (hidden comment: LED)

### Ports
RASP_ETH_RX_N, RASP_ETH_RX_P, RASP_ETH_TX_N, RASP_ETH_TX_P, RASP_USB_N, RASP_USB_P

### Nets
+1,8BA: C114.2 C115.2 C116.2 DD8.15(VDD18CORE) DD8.38(VDD18CORE) DD8.48(VDD18ETHPLL)
+1,8BD: C117.2 DD8.62(VDD18USBPLL)
+3,3BA: C107.2 C108.2 C109.2 C110.2 C111.2 C112.2 C113.2 DD8.5(VDD33A) DD8.10(VDD33A) DD8.49(VDD33A) DD8.51(VDD33A) DD8.54(VDD33A) DD8.57(VDD33A) DD8.64(VDD33A)
+3,3BD: C102.2 C103.2 C104.2 C105.2 C106.2 C118.2 C119.2 DD8.11(VBUS_DET) DD8.19(VDD33IO) DD8.27(VDD33IO) DD8.28(nTRST) DD8.29(TMS) DD8.30(TDI) DD8.33(VDD33IO) DD8.39(VDD33IO) DD8.40(TEST3) DD8.46(VDD33IO) G3.4(VCC) R93.2 R94.1 R98.1 VD17.2(A) VD18.2(A) VD19.2(A)
AGND: C107.1 C108.1 C109.1 C110.1 C111.1 C112.1 C113.1 C114.1 C115.1 C116.1 DD8.65(PWRPAD) R96.2
DGND: C102.1 C103.1 C104.1 C105.1 C106.1 C117.1 C118.1 C119.1 DD8.34(TEST2) DD8.44(CLK24_EN) G3.2(GND) R95.1 SW4.2
NetDD6_5: DD8.52(RXP) ; port RASP_ETH_RX_P
NetDD6_6: DD8.53(RXN) ; port RASP_ETH_RX_N
NetDD6_9: DD8.55(TXP) ; port RASP_ETH_TX_P
NetDD6_10: DD8.56(TXN) ; port RASP_ETH_TX_N
NetDD8_12: DD8.12(nRESET) R94.2 SW4.1
NetDD8_20: DD8.20(nFDX_LED/GPIO0) R97.1
NetDD8_21: DD8.21(nLNKA_LED/GPIO1) R99.1
NetDD8_22: DD8.22(nSPD_LED/GPIO2) R100.1
NetDD8_32: DD8.32(TCK) R98.2
NetDD8_41: DD8.41(AUTOMDIX_EN) R93.1
NetDD8_50: DD8.50(EXRES) R96.1
NetDD8_58: DD8.58(USBDM0) L2.2
NetDD8_59: DD8.59(USBDP0) L2.1
NetDD8_61: DD8.61(XI) G3.3(DCLK)
NetDD8_63: DD8.63(USBRBIAS) R95.2
NetL2_3: L2.3 ; port RASP_USB_P
NetL2_4: L2.4 ; port RASP_USB_N
NetR97_2: R97.2 VD17.1(K)
NetR99_2: R99.2 VD18.1(K)
NetR100_2: R100.2 VD19.1(K)

Not connected (* = marked no-connect by the designer): DD8 1(USBDM2)* 2(USBDP2)* 3(USBDM3)* 4(USBDP3)* 6(USBDM4)* 7(USBDP4)* 8(USBDM5)* 9(USBDP5)* 13(TEST1)* 14(PRTCTL2)* 16(PRTCTL3)* 17(PRTCTL4)* 18(PRTCTL5)* 23(EECLK)* 24(EECS)* 25(EEDO)* 26(EEDI)* 31(TDO)* 35(GPIO3)* 36(GPIO4)* 37(GPIO5)* 42(GPIO6)* 43(GPIO7)* 45(CLK24_OUT)* 47(TEST4)* 60(XO)*; G3 1(NC)*

### Notes on the sheet
- На лист 2
- На лист 4
- full-duplex mode
- valid link
- operating speed is 100 Mbs
- or 10Mbs and lineIsolation
- Подп. и дата
- Инв. № дубл.
- Взам. инв. №
- 0,5 Ампер
- Инв. № подл.
- Лист
- Изм.
- № докум.
- Подп.
- Дата
- Копировал
- Формат
- (in symbol crystal9) G
- (in symbol interf25) ETH-USB

### Library data of the parts
C102-C117 C119 = cap277: as C3 on sheet MainBoard_MCU
C118 = cap133: as C4 on sheet MainBoard_MCU
DD8 = interf25: USB 2.0 Hub and 10/100 Ethernet Controller; Manufacture: Microchip; Number of Channel: 4; Type Supply: Single Polar; Current Consumption: 288мА; Power Supply: 3,3В; id: interf25; Part Name: USB 2.0 Hub and 10/100 Ethernet Controller; Part Number: LAN9514I
G3 = crystal9: as G2 on sheet MainBoard_ETH; id: crystal9
L2 = ind68: Синфазный дроссель; Part Name: Ind Common Mode Choke USB EMI; Manufacture: Murata; id: ind68; Resistance: 0,35Ohm
R93 R94 R98 = res294: as R1 on sheet MainBoard_MCU; Part Name: Resistor; Power: 0,062Вт
R95 = res296: Резистор; Manufacture: Yageo; Part Number: RC0402FR-0712KL; id: res296; Accuracy: 0,01; Part Name: Resistor; Power: 0,062Вт
R96 = res979: Резистор; Manufacture: Yageo; Part Number: RC0402FR-0712K4L; id: res979; Accuracy: 0,01; Part Name: Resistor; Power: 0,062Вт
R97 R99 R100 = res258: Резистор; Manufacture: Yageo; Part Number: RC0402FR-07330RL; id: res258; Accuracy: 0,01; Part Name: Resistor; Power: 0,062Вт
SW4 = btn9: as SW1 on sheet MainBoard_ETH
VD17 = diode28: Светодиод; Part Number: KPHHS-1005SURCK; id: diode28
VD18 = diode30: Светодиод; Part Number: KPHHS-1005MGCK; id: diode30
VD19 = diode29: Светодиод; Part Number: KPHHS-1005SYCK; id: diode29